# EAGLE board T-Bone_V101 (EAGLE 6.5.0), part 1 of 3
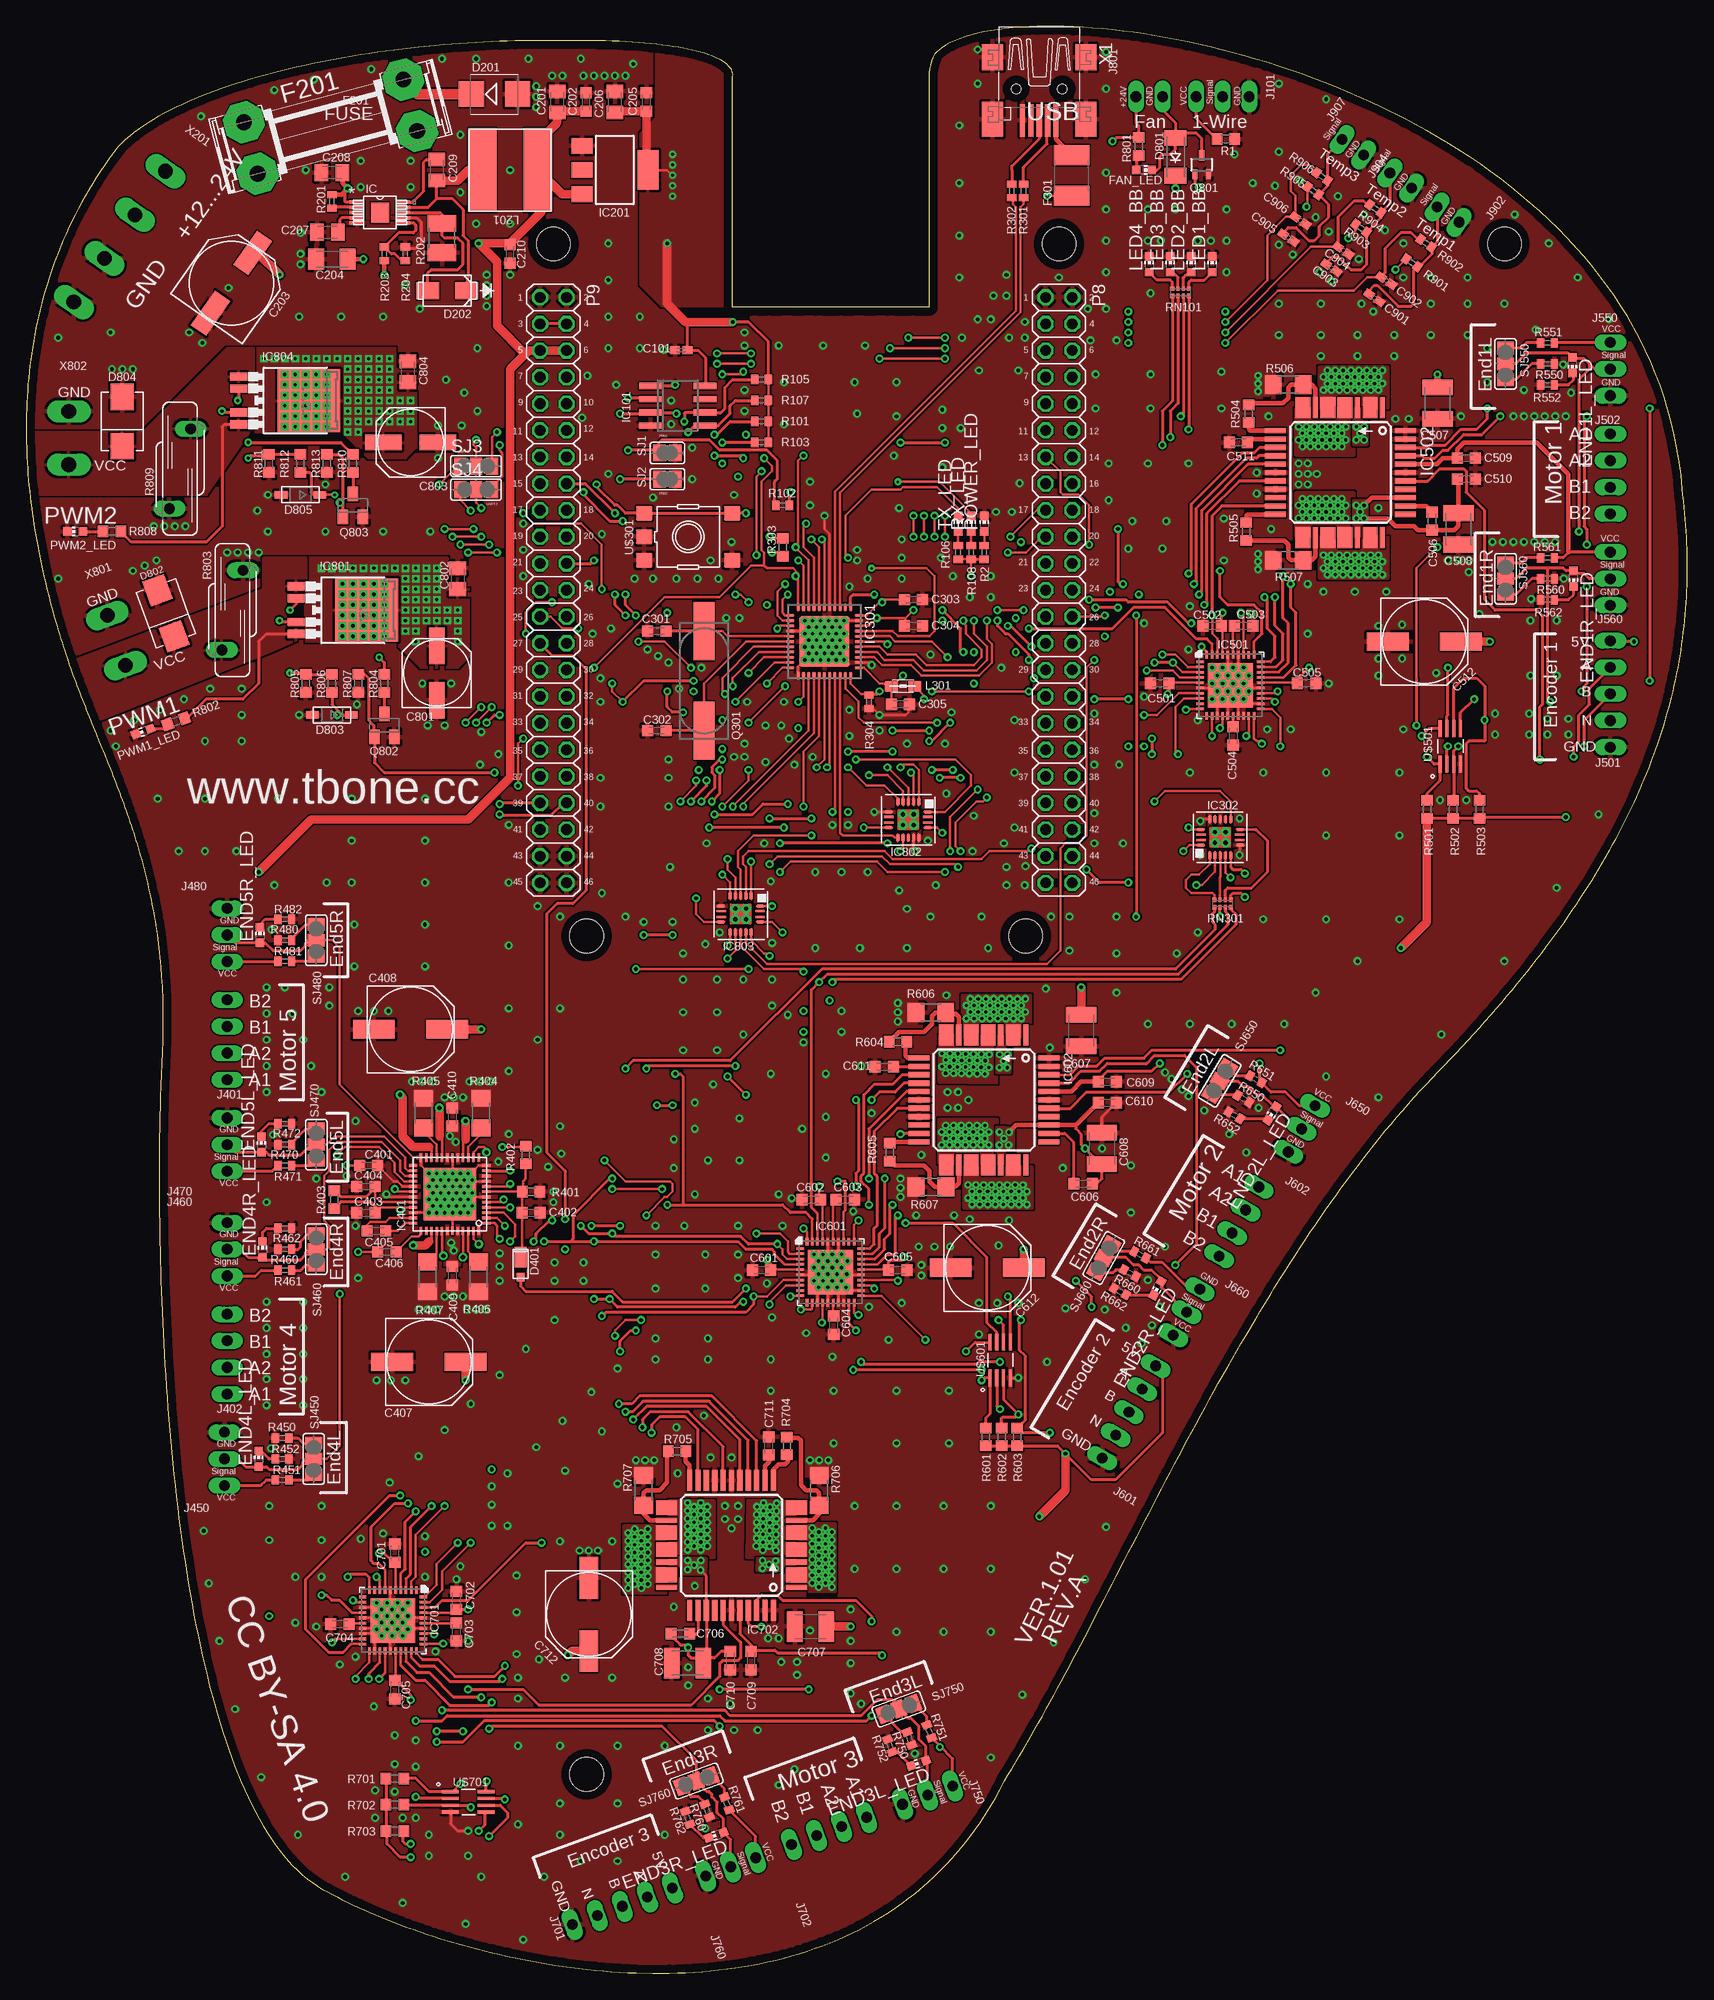
[diagram p10: board, top side]
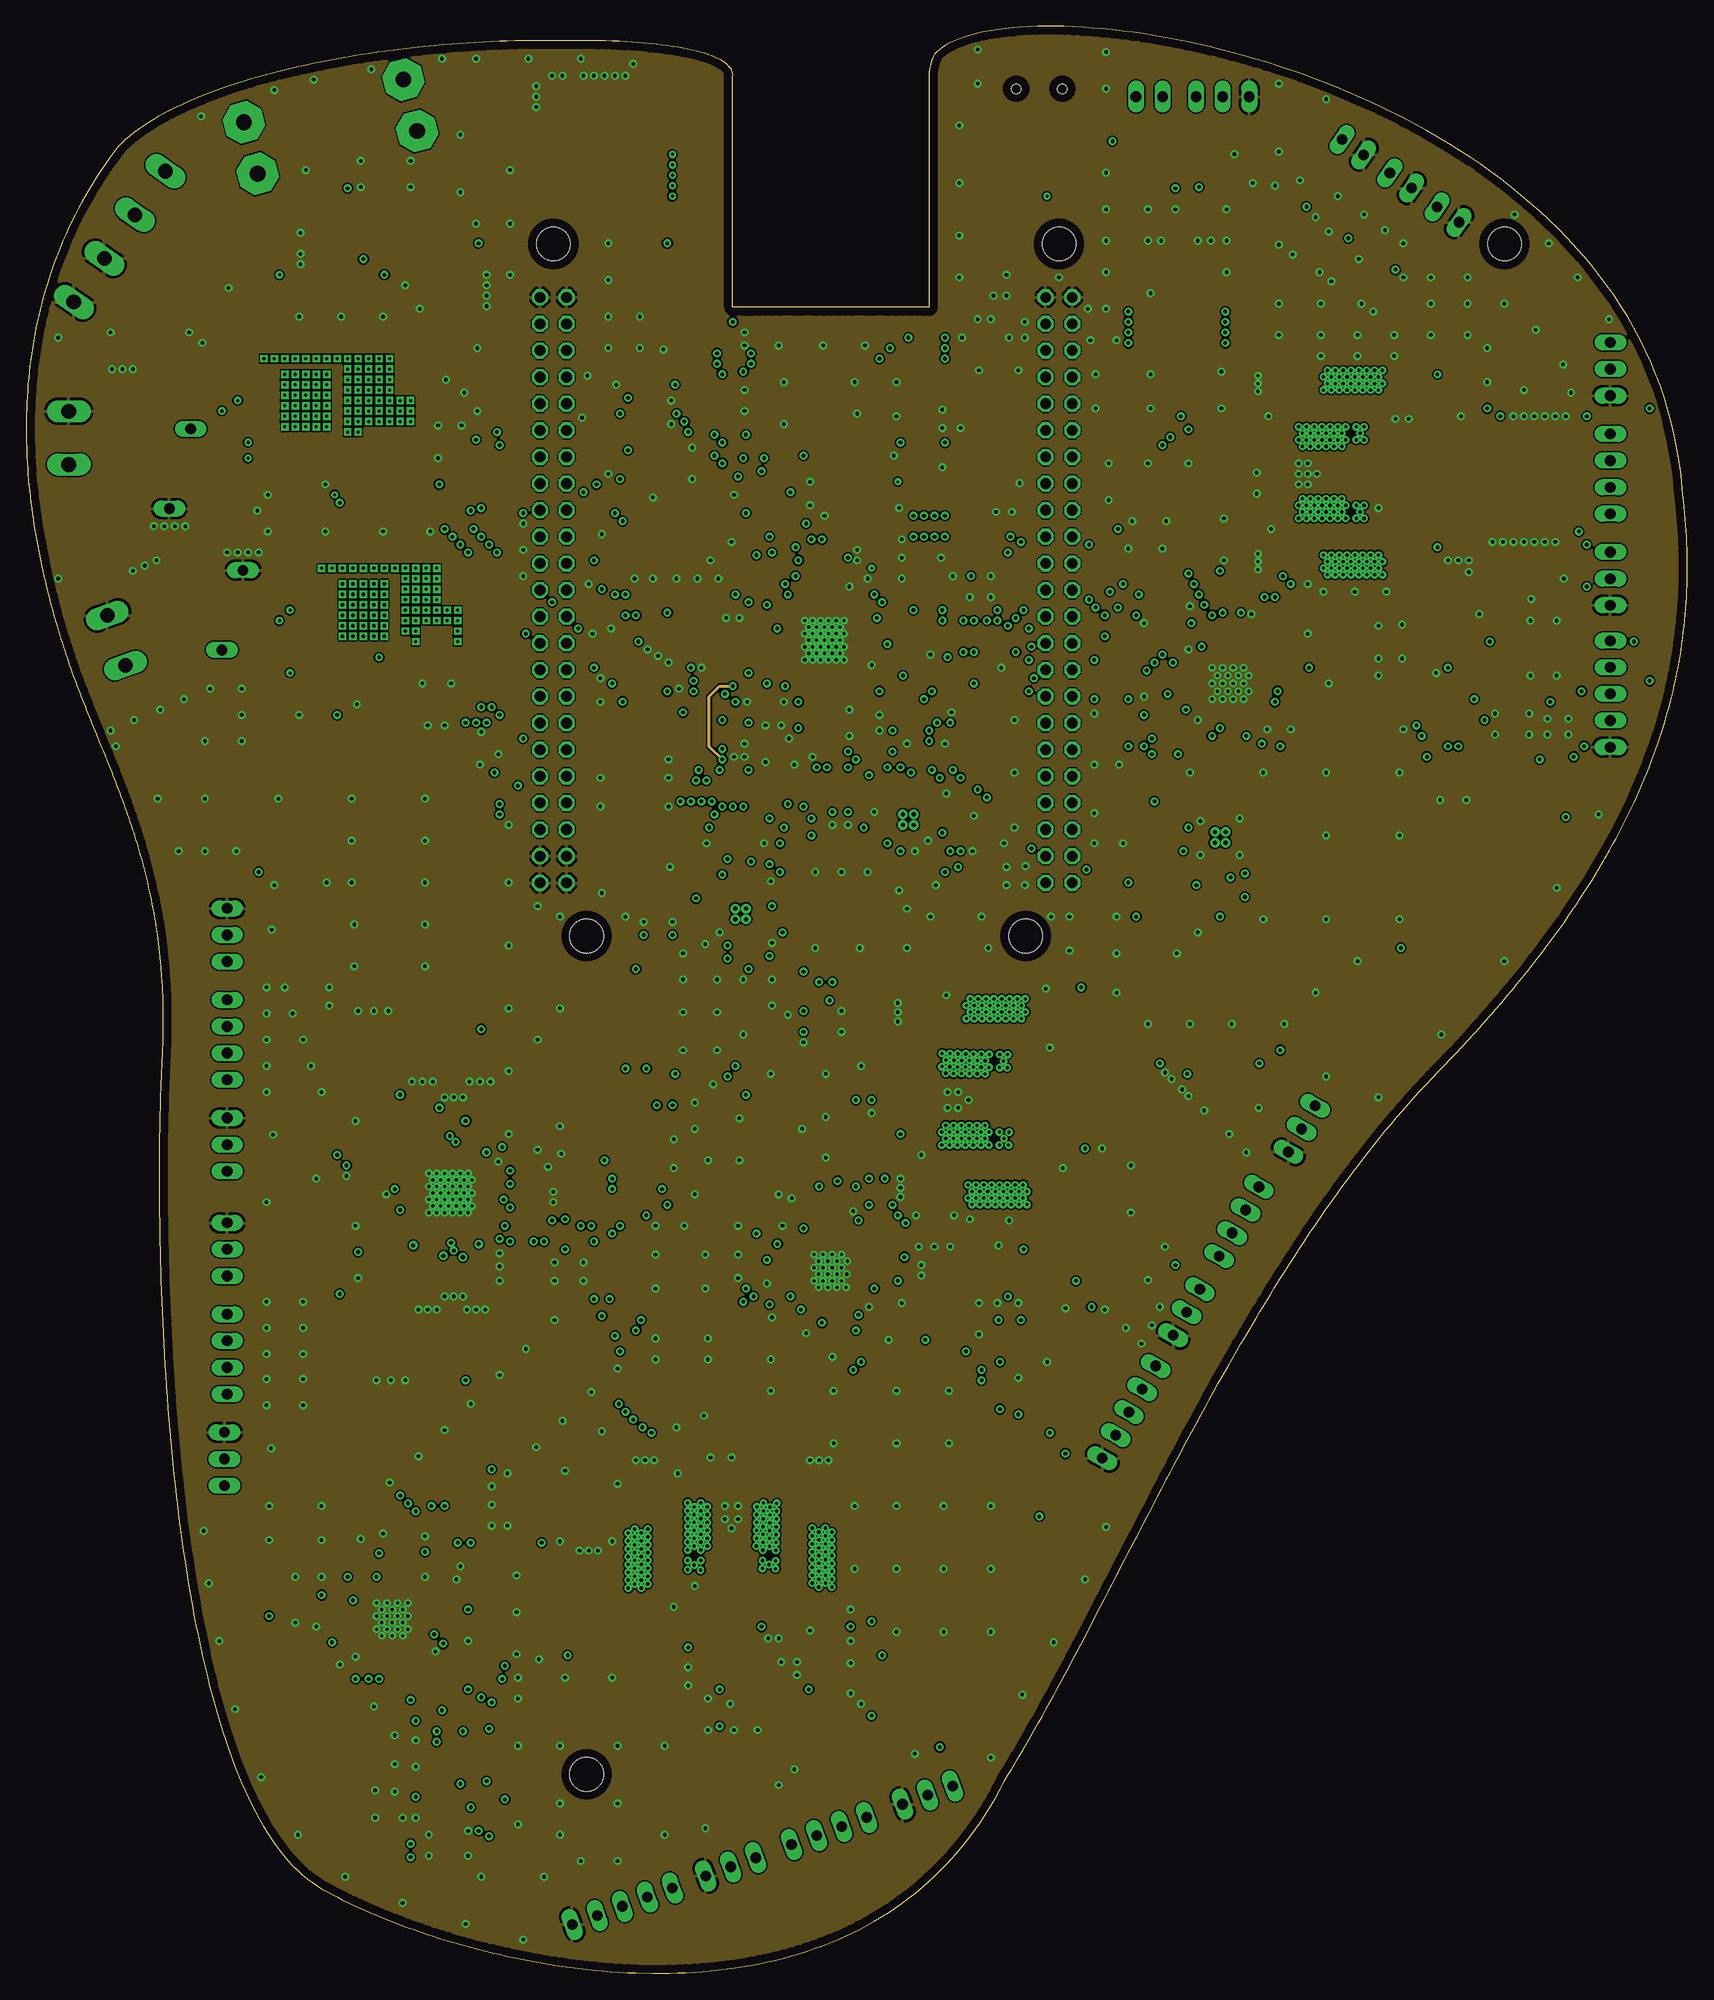
[diagram p11: board, inner layer Ground]
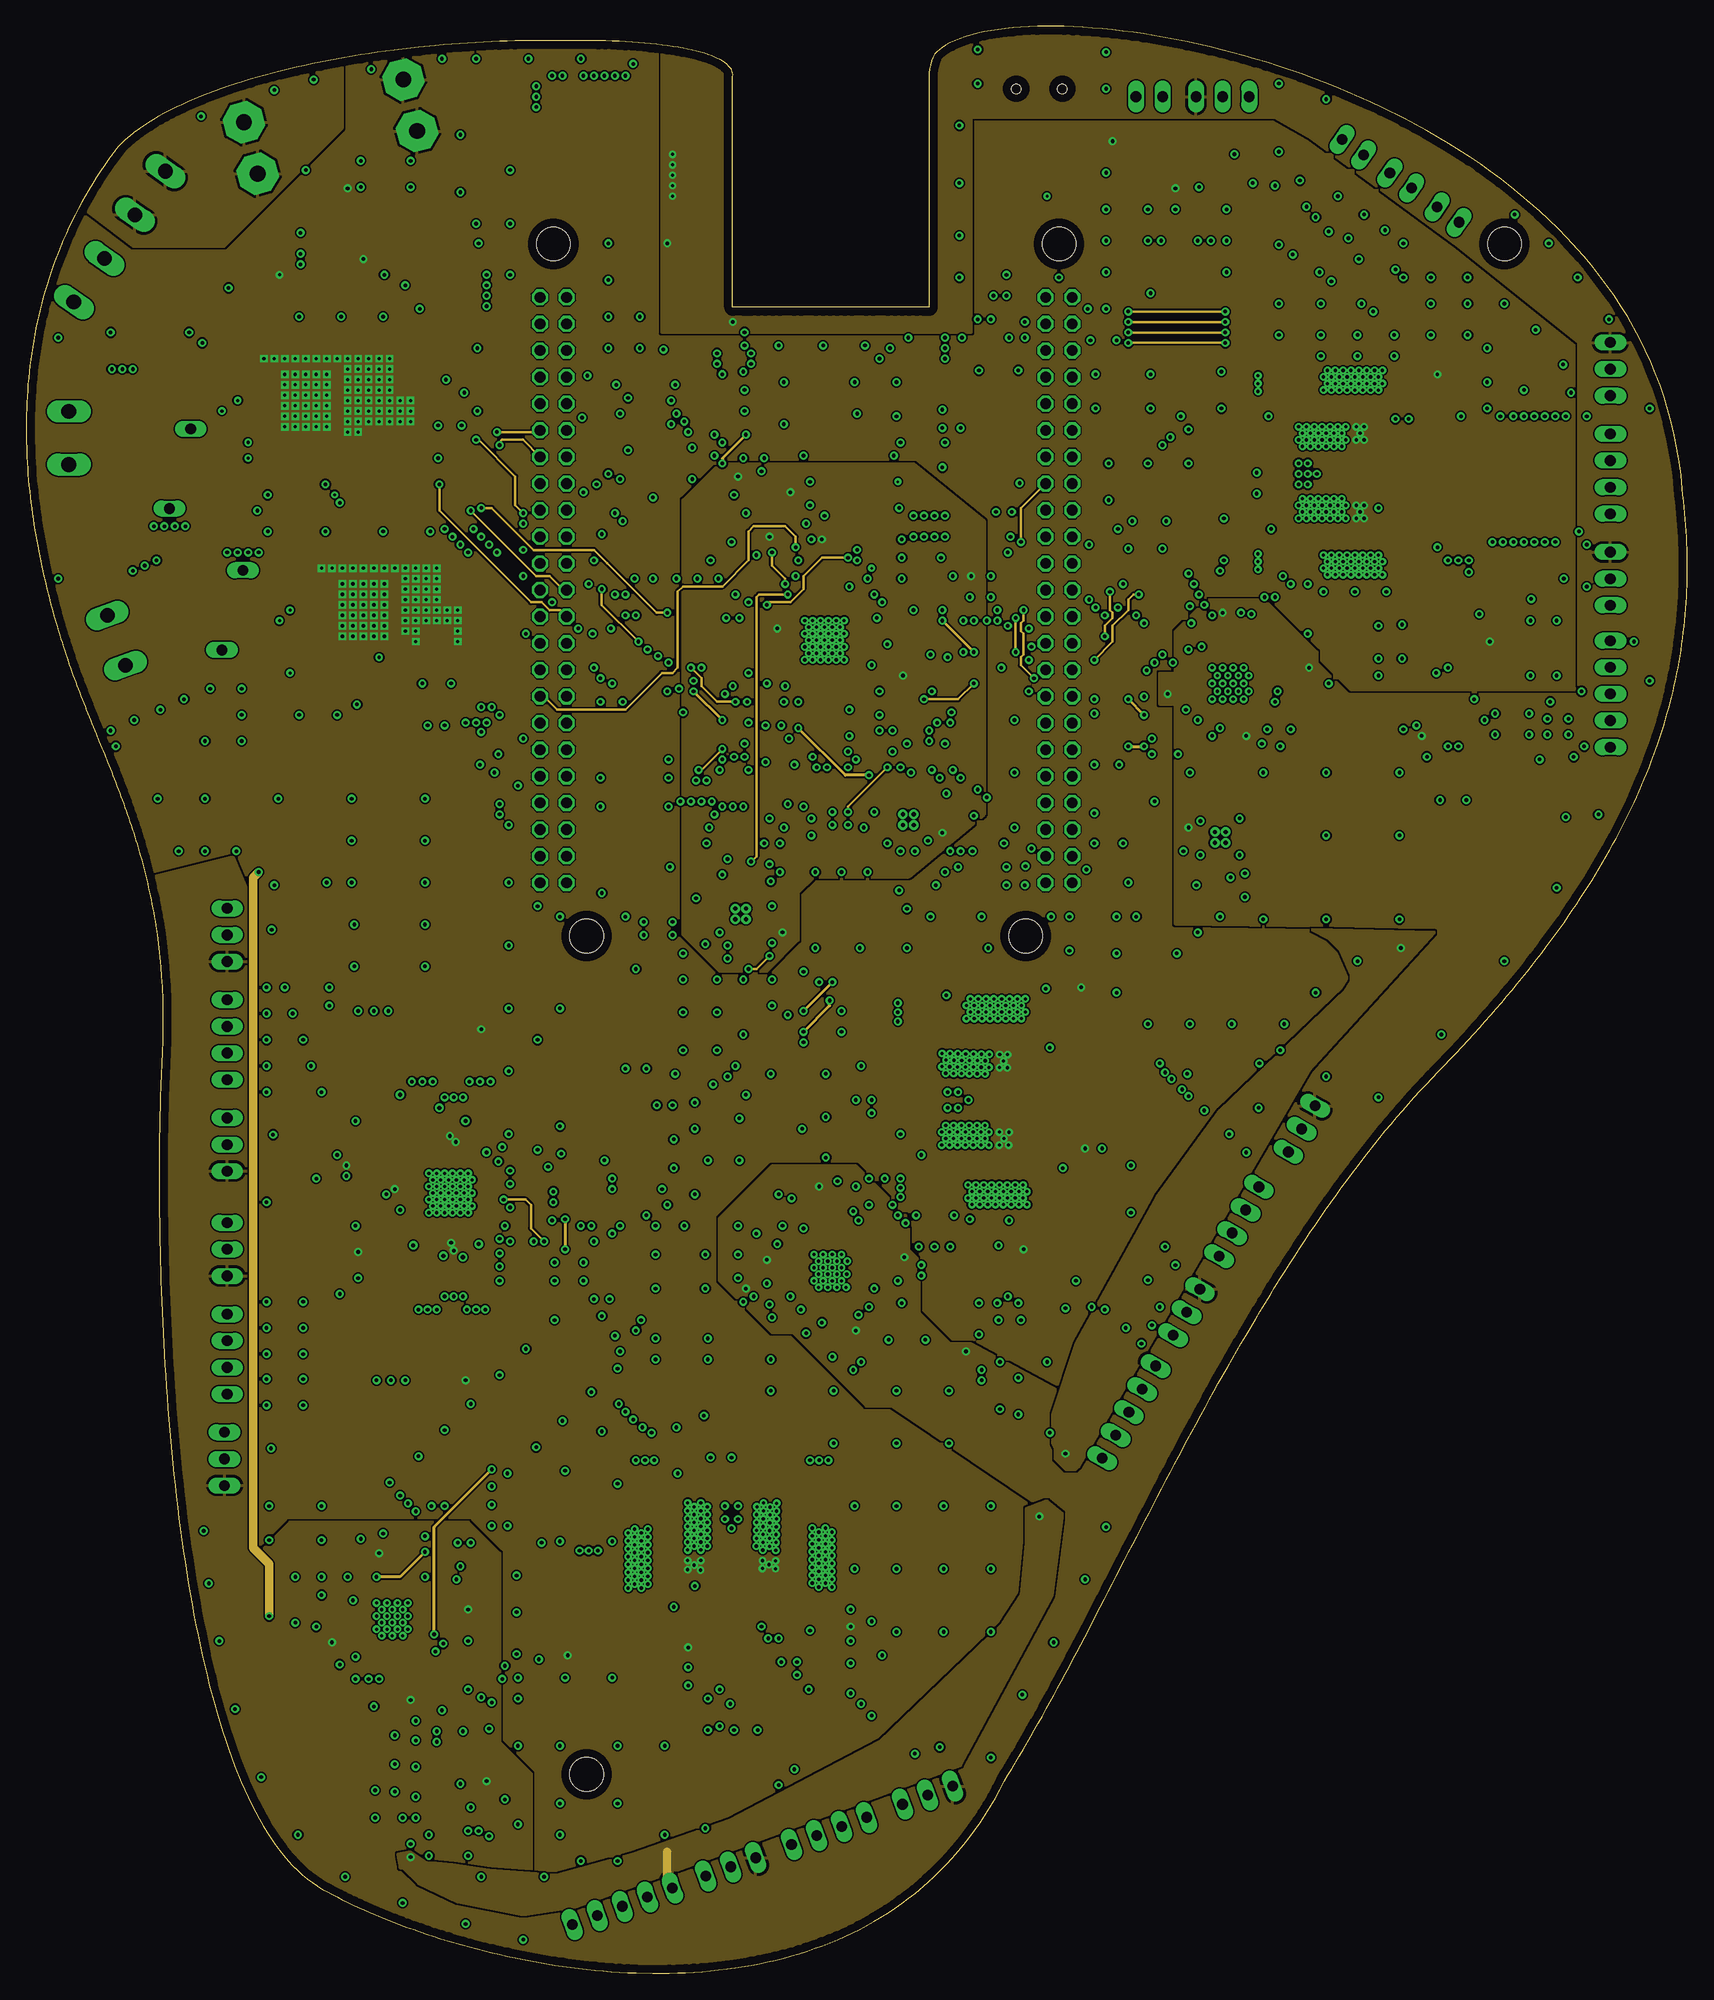
[diagram p12: board, inner layer Supply]
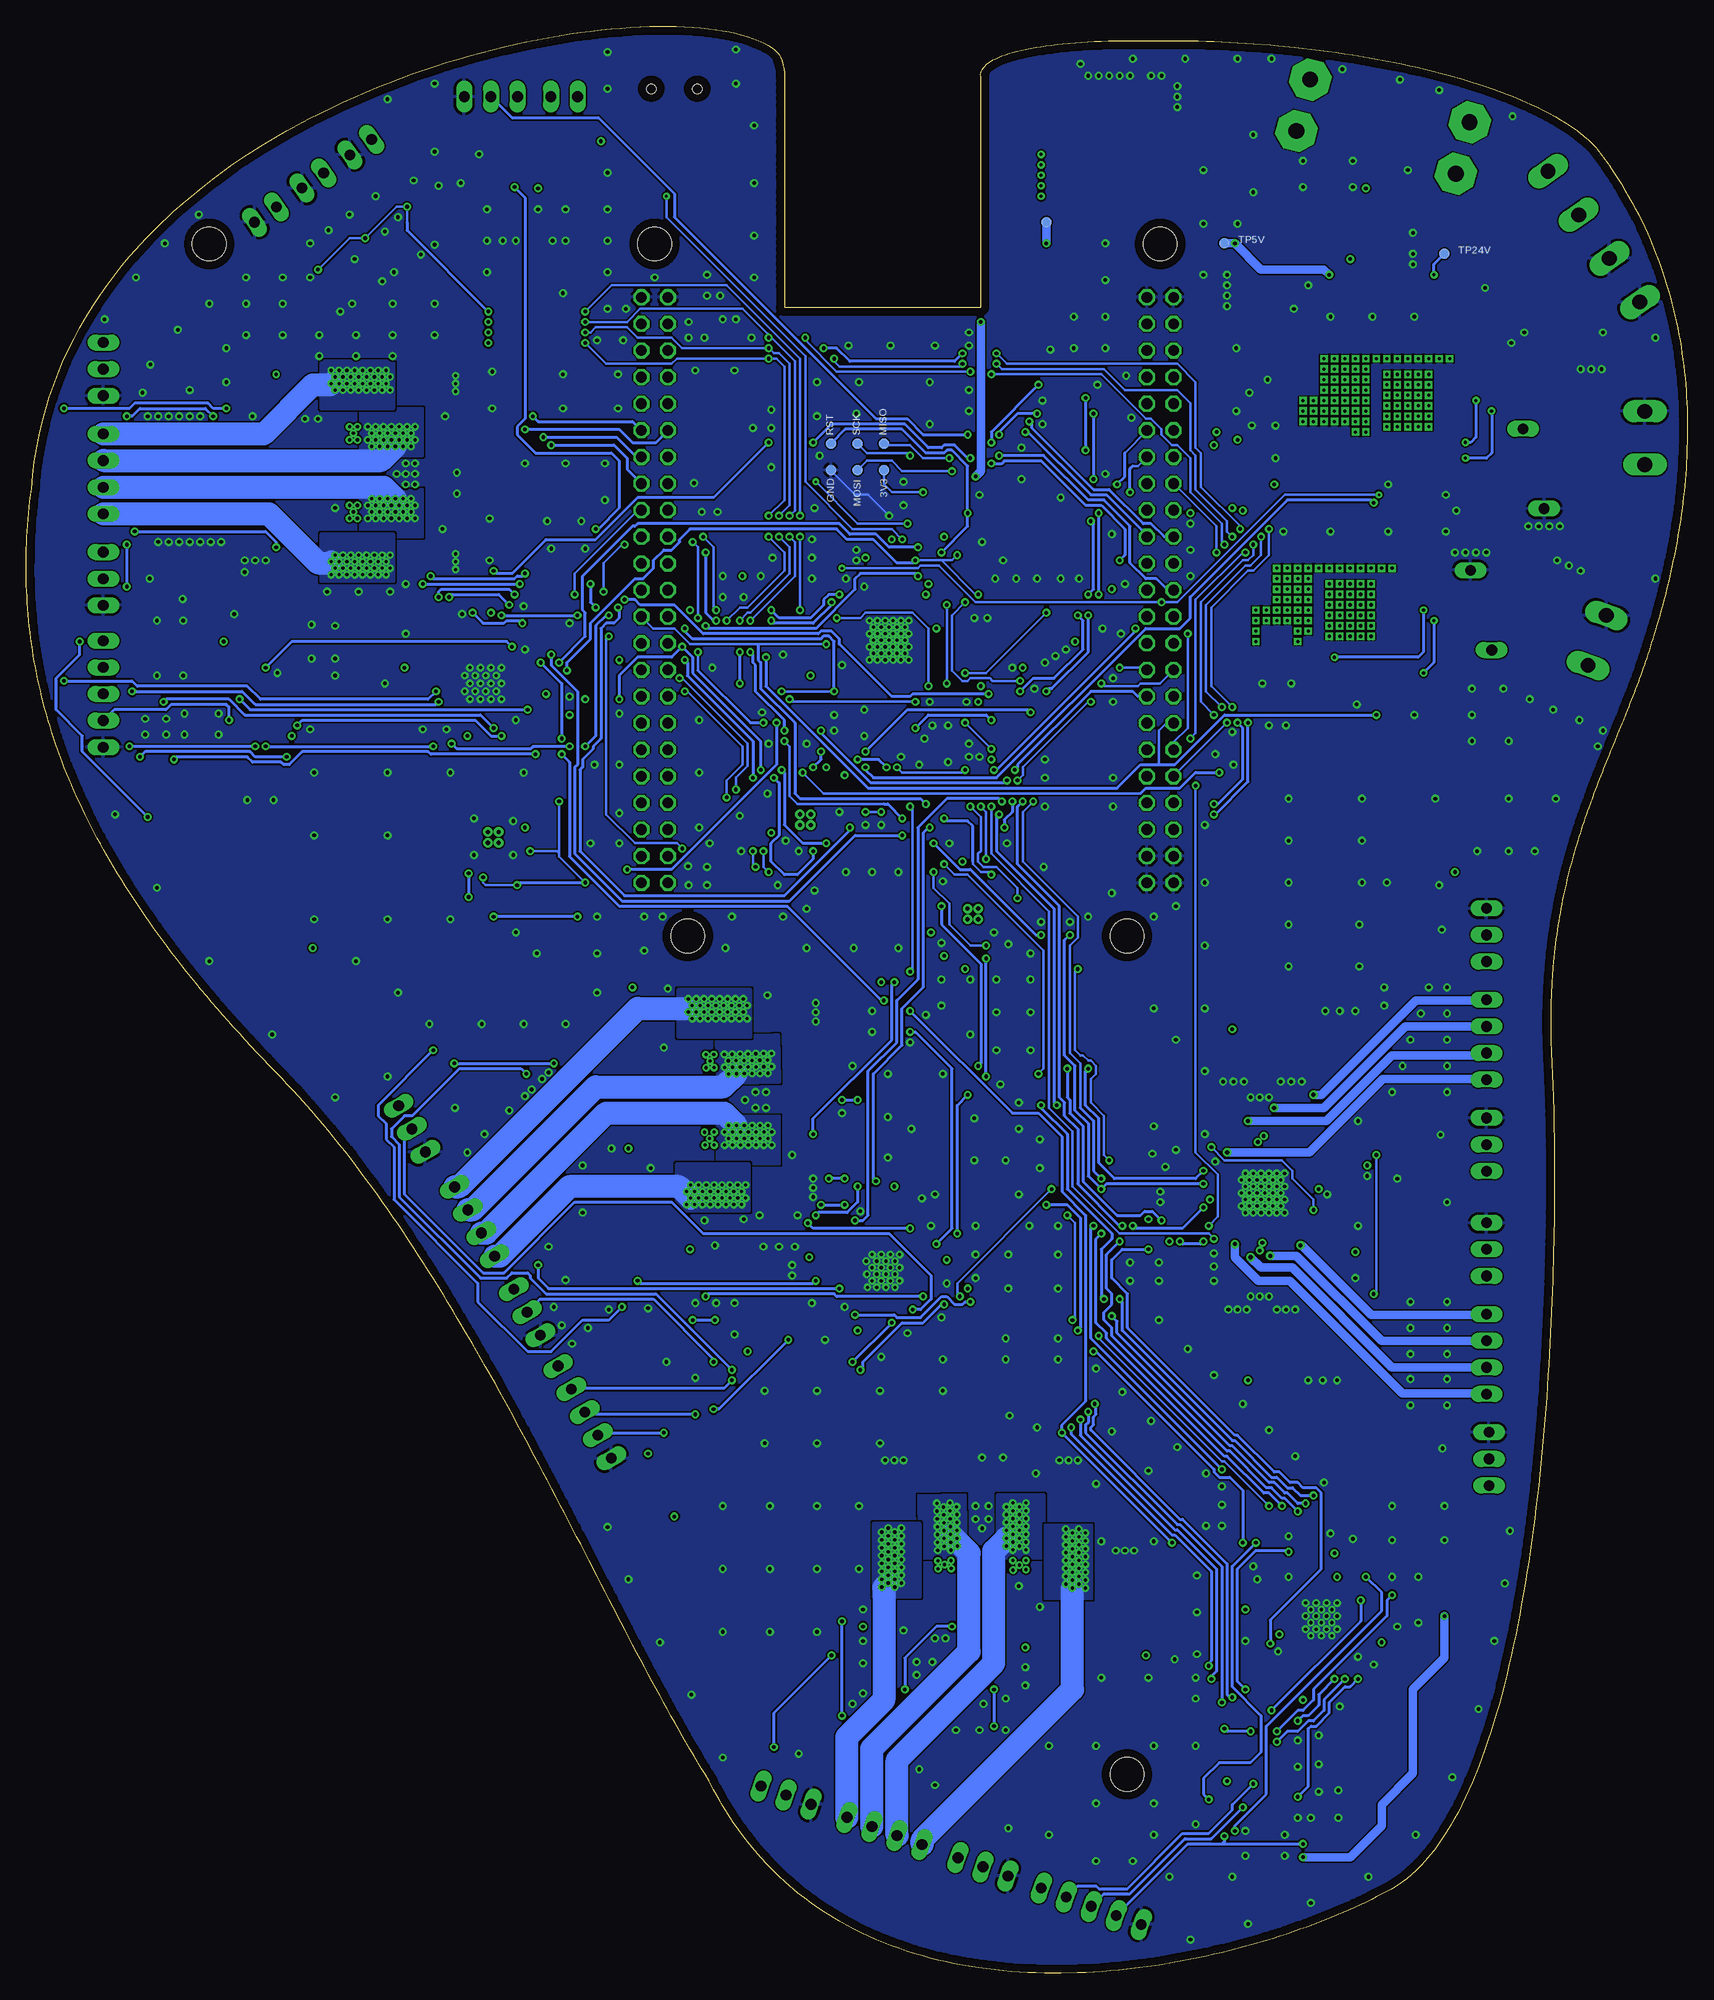
[diagram p13: board, bottom side, seen from below]

Size 158.54 x 185.81 mm. Coordinates in mm from the lower left corner, seen from the top.
Outline: 783 segments
Copper layers (1*2*15*16): Top 0.018mm / dielectric 0.36mm / Ground 0.035mm / dielectric 0.71mm / Supply 0.035mm / dielectric 0.2mm / Bottom 0.018mm
Design rules "Default_WE_Euro *": minimum track width 0.15mm, minimum drill 0.25mm, track to track 0.15mm, track to pad 0.15mm, pad to pad 0.1mm, via to via 0.15mm, smd to smd 0mil, copper to edge 0.8mm, drill to drill 8mil, minimum pad ring 10mil, minimum via ring 8mil, stop-mask expansion 4mil, vias tented up to drill 0.4mm, thermal gap 10mil
Net classes: 1 coil_current: width 0.254 mm, drill 1.2 mm, clearance 0.254 mm
Holes 3.2 mm at 50.31,165.03 98.57,165.03 95.39,98.99 53.48,98.99 141.07,165.03 53.48,18.99

## Footprints (pad centres in the part's own frame; a part is rotated, then mirrored left to right if it is on the bottom)
TP = smd 1 x 1: P$1 0,0
C0402K = smd 0.925 x 0.74: 1 -0.6,0; 2 0.6,0
C0805K = smd 1.3 x 1.6: 1 -1,0; 2 1,0
C0603K = smd 1.05 x 1.08: 1 -0.875,0; 2 0.875,0
F = smd 1.75 x 4: 1 0,-3.5; 2 0,3.5
C1206K = smd 1.5 x 2: 1 -1.5,0; 2 1.5,0
C1210K = smd 1.5 x 2.9: 1 -1.5,0; 2 1.5,0
D8 = smd 1.5 x 3.5: 1 0,-2.6; 2 0,2.6
SMB = smd 2.4 x 2.4: A 2.2,0; C -2.2,0
SMA = smd 2.184 x 1.626: 1 -1.854,0; 2 1.854,0
MSS1PX = smd 2 x 1.1: 1 -1.25,0 | smd 0.8 x 0.8: 2 0.65,0
SOD-123_MINI-SMA = smd 1.5 x 2.1: A 1.8,0; C -1.8,0
SMB' = smd 2.5 x 2.2: A 2.35,0; C -2.35,0
SOD-123 = smd 1.2 x 0.7: A 1.85,0; C -1.85,0
CHIP-LED0603 = smd 0.8 x 0.8: A 0,-0.75; C 0,0.75
SHK20Q = drill 1.5 pad 3.81 octagon: 1A -7.874,2.54; 1B -7.874,-2.54; 2A 7.874,2.54; 2B 7.874,-2.54
L1812 = smd 1.9 x 3.4: 1 -1.95,0; 2 1.95,0
MUC10A = smd 1.372 x 0.33: 1 -2.184,0.991; 2 -2.184,0.508; 3 -2.184,0; 4 -2.184,-0.508; 5 -2.184,-0.991; 6 2.184,-0.991; 7 2.184,-0.508; 8 2.184,0; 9 2.184,0.508; 10 2.184,0.991 | smd 1.727 x 1.905: EPAD 0,0
SO-08 = smd 0.6 x 2.2: 1 -1.905,-2.6; 2 -0.635,-2.6; 3 0.635,-2.6; 4 1.905,-2.6; 5 1.905,2.6; 6 0.635,2.6; 7 -0.635,2.6; 8 -1.905,2.6
SOT223 = smd 1.5 x 2: 1 -2.3,-3.15; 2 0,-3.15; 3 2.3,-3.15 | smd 3.8 x 2: 4 0,3.15
QFN44ML7X7 = smd 0.75 x 0.275: 1 -3.275,2.5; 2 -3.275,2; 3 -3.275,1.5; 4 -3.275,1; 5 -3.275,0.5; 6 -3.275,0; 7 -3.275,-0.5; 8 -3.275,-1; 9 -3.275,-1.5; 10 -3.275,-2; 11 -3.275,-2.5; 23 3.275,-2.5; 24 3.275,-2; 25 3.275,-1.5; 26 3.275,-1; 27 3.275,-0.5; 28 3.275,0; 29 3.275,0.5; 30 3.275,1; 31 3.275,1.5; 32 3.275,2; 33 3.275,2.5 | smd 0.275 x 0.75: 12 -2.5,-3.275; 13 -2,-3.275; 14 -1.5,-3.275; 15 -1,-3.275; 16 -0.5,-3.275; 17 0,-3.275; 18 0.5,-3.275; 19 1,-3.275; 20 1.5,-3.275; 21 2,-3.275; 22 2.5,-3.275; 34 2.5,3.275; 35 2,3.275; 36 1.5,3.275; 37 1,3.275; 38 0.5,3.275; 39 0,3.275; 40 -0.5,3.275; 41 -1,3.275; 42 -1.5,3.275; 43 -2,3.275; 44 -2.5,3.275 | smd 4.826 x 4.826: EXP 0,0
14-VFQFN = smd 0.85 x 0.28: 1 1.875,0.75; 7 -1.875,0.75; 8 -1.875,-0.75; 14 1.875,-0.75 | smd 0.28 x 0.85: 2 1,1.725; 3 0.5,1.725; 4 0,1.725; 5 -0.5,1.725; 6 -1,1.725; 9 -1,-1.725; 10 -0.5,-1.725; 11 0,-1.725; 12 0.5,-1.725; 13 1,-1.725 | smd 0.9 x 0.2: THERM@1 1.85,-0.275; THERM@2 1.85,0.275; THERM@3 -1.85,0.275; THERM@4 -1.85,-0.275 | drill 0.406: THERM@5 -0.512,0.512; THERM@6 -0.512,-0.512; THERM@7 0.512,-0.512; THERM@8 0.512,0.512
QFN48 = smd 0.25 x 0.8: 1 -2.75,-3.5; 2 -2.25,-3.5; 3 -1.75,-3.5; 4 -1.25,-3.5; 5 -0.75,-3.5; 6 -0.25,-3.5; 7 0.25,-3.5; 8 0.75,-3.5; 9 1.25,-3.5; 10 1.75,-3.5; 11 2.25,-3.5; 12 2.75,-3.5; 25 2.75,3.5; 26 2.25,3.5; 27 1.75,3.5; 28 1.25,3.5; 29 0.75,3.5; 30 0.25,3.5; 31 -0.25,3.5; 32 -0.75,3.5; 33 -1.25,3.5; 34 -1.75,3.5; 35 -2.25,3.5; 36 -2.75,3.5 | smd 0.8 x 0.25: 13 3.5,-2.75; 14 3.5,-2.25; 15 3.5,-1.75; 16 3.5,-1.25; 17 3.5,-0.75; 18 3.5,-0.25; 19 3.5,0.25; 20 3.5,0.75; 21 3.5,1.25; 22 3.5,1.75; 23 3.5,2.25; 24 3.5,2.75; 37 -3.5,2.75; 38 -3.5,2.25; 39 -3.5,1.75; 40 -3.5,1.25; 41 -3.5,0.75; 42 -3.5,0.25; 43 -3.5,-0.25; 44 -3.5,-0.75; 45 -3.5,-1.25; 46 -3.5,-1.75; 47 -3.5,-2.25; 48 -3.5,-2.75 | smd 5 x 5: 49 0,0
QFN40L = smd 0.7 x 0.25: 1 -2.9,2.25; 2 -2.9,1.75; 3 -2.9,1.25; 4 -2.9,0.75; 5 -2.9,0.25; 6 -2.9,-0.25; 7 -2.9,-0.75; 8 -2.9,-1.25; 9 -2.9,-1.75; 10 -2.9,-2.25; 21 2.9,-2.25; 22 2.9,-1.75; 23 2.9,-1.25; 24 2.9,-0.75; 25 2.9,-0.25; 26 2.9,0.25; 27 2.9,0.75; 28 2.9,1.25; 29 2.9,1.75; 30 2.9,2.25 | smd 0.25 x 0.7: 11 -2.25,-2.9; 12 -1.75,-2.9; 13 -1.25,-2.9; 14 -0.75,-2.9; 15 -0.25,-2.9; 16 0.25,-2.9; 17 0.75,-2.9; 18 1.25,-2.9; 19 1.75,-2.9; 20 2.25,-2.9; 31 2.25,2.9; 32 1.75,2.9; 33 1.25,2.9; 34 0.75,2.9; 35 0.25,2.9; 36 -0.25,2.9; 37 -0.75,2.9; 38 -1.25,2.9; 39 -1.75,2.9; 40 -2.25,2.9 | smd 4.26 x 4.26: EXP 0,0
PQFP44_WITH_PADS = smd 2 x 0.5: 1 -6.327,4.254; 4 -6.327,1.854; 9 -6.327,-2.146; 25 6.073,-2.146; 30 6.073,1.854; 33 6.073,4.254 | smd 2 x 1.4: 2 -6.327,3.06; 5 -6.327,0.66; 7 -6.327,-0.965; 10 -6.327,-3.34; 23 6.073,-3.34; 26 6.073,-0.965; 28 6.073,0.66; 31 6.073,3.06 | smd 0.5 x 2: 12 -4.127,-5.946; 13 -3.327,-5.946; 14 -2.527,-5.946; 15 -1.727,-5.946; 16 -0.927,-5.946; 17 -0.127,-5.946; 18 0.673,-5.946; 19 1.473,-5.946; 20 2.273,-5.946; 21 3.073,-5.946; 22 3.873,-5.946; 34 3.873,6.454; 35 3.073,6.454; 36 2.273,6.454; 37 1.473,6.454; 38 0.673,6.454; 39 -0.127,6.454; 40 -0.927,6.454; 41 -1.727,6.454; 42 -2.527,6.454; 43 -3.327,6.454; 44 -4.127,6.454
TO252-5-11 = smd 0.8 x 1.6: 1 -2.28,-5.41; 2 -1.14,-5.41; 4 1.14,-5.41; 5 2.28,-5.41 | smd 6 x 6: TAB 0,1.3
7395-03 = drill 1.016 long: 1 2.54,0; 2 0,0; 3 -2.54,0
7395-04 = drill 1.016 long: 1 3.81,0; 2 1.27,0; 3 -1.27,0; 4 -3.81,0
7395-05 = drill 1.016 long: 1 5.08,0; 2 2.54,0; 3 0,0; 4 -2.54,0; 5 -5.08,0
7395-02 = drill 1.016 long: 1 1.27,0; 2 -1.27,0
SDR0805 = smd 2.692 x 8.001: 1 -2.642,0; 2 2.642,0
0805 = smd 1.2 x 1: 1 -1.1,0; 2 1.1,0
2X23 = drill 1.016 octagon: 1 -25.4,-1.27; 2 -25.4,1.27; 3 -22.86,-1.27; 4 -22.86,1.27; 5 -20.32,-1.27; 6 -20.32,1.27; 7 -17.78,-1.27; 8 -17.78,1.27; 9 -15.24,-1.27; 10 -15.24,1.27; 11 -12.7,-1.27; 12 -12.7,1.27; 13 -10.16,-1.27; 14 -10.16,1.27; 15 -7.62,-1.27; 16 -7.62,1.27; 17 -5.08,-1.27; 18 -5.08,1.27; 19 -2.54,-1.27; 20 -2.54,1.27; 21 0,-1.27; 22 0,1.27; 23 2.54,-1.27; 24 2.54,1.27; 25 5.08,-1.27; 26 5.08,1.27; 27 7.62,-1.27; 28 7.62,1.27; 29 10.16,-1.27; 30 10.16,1.27; 31 12.7,-1.27; 32 12.7,1.27; 33 15.24,-1.27; 34 15.24,1.27; 35 17.78,-1.27; 36 17.78,1.27; 37 20.32,-1.27; 38 20.32,1.27; 39 22.86,-1.27; 40 22.86,1.27; 41 25.4,-1.27; 42 25.4,1.27; 43 27.94,-1.27; 44 27.94,1.27; 45 30.48,-1.27; 46 30.48,1.27
CSM-7X-DU = smd 5.5 x 2: 1 -4.75,0; 2 4.75,0
SOT323 = smd 0.5 x 1: 1 0,0.9; 2 -0.65,-0.9; 3 0.65,-0.9
SOT23 = smd 1 x 1.4: 1 -0.95,-1.1; 2 0.95,-1.1; 3 0,1.1
R0603 = smd 1 x 1.1: 1 -0.85,0; 2 0.85,0
R0402 = smd 0.7 x 0.9: 1 -0.65,0; 2 0.65,0
R1210 = smd 1.6 x 2.7: 1 -1.4,0; 2 1.4,0
R1206 = smd 1.6 x 1.803: 1 -1.422,0; 2 1.422,0
S10K40 = drill 1.016 long: 1 -1.016,-3.81; 2 1.016,3.81
YC124 = smd 0.4 x 0.4: 1 -0.8,-0.35; 4 0.8,-0.35; 5 0.8,0.35; 8 -0.8,0.35 | smd 0.3 x 0.4: 2 -0.25,-0.35; 3 0.25,-0.35; 6 0.25,0.35; 7 -0.25,0.35
SJ = smd 1.168 x 1.6: 1 -0.762,0; 2 0.762,0
SJ_2 = smd 1.168 x 1.6: 1 -1.524,0; 2 0,0; 3 1.524,0
TS42 = smd 1.6 x 1.4: 1 -4.2,2.25; 2 4.2,2.25; 3 -4.2,-2.25; 4 4.2,-2.25; 5 -4.2,0
SN74LVC3G17-SM8 = smd 1.6 x 0.3: P$1 -1.7,1; P$2 -1.7,0.35; P$3 -1.7,-0.3; P$4 -1.7,-0.95; P$5 1.7,-0.95; P$6 1.7,-0.3; P$7 1.7,0.35; P$8 1.7,1
32005-301 = smd 3.1 x 0.5: 1 3,1.6; 2 3,0.8; 3 3,0; 4 3,-0.8; 5 3,-1.6 | smd 2.5 x 2: M1 -3,-4.45; M2 -3,4.45 | smd 3.3 x 2: M3 2.9,4.45; M4 2.9,-4.45 | hole 0.9: 0,2.2; 0,-2.2
MSTBA4 = drill 1.397 long: 1 -7.62,5.08; 2 -2.54,5.08; 3 2.54,5.08; 4 7.62,5.08
MSTBA2 = drill 1.397 long: 1 -2.54,5.08; 2 2.54,5.08

## Placement (x,y rotation side)
3V3  TP  [TP]  76.66,143.45 270 bottom
C101  100nF/10V  [C0402K]  62.51,154.91 180 top
C201  10µF/10V  [C0805K]  50.68,178.59 90 top
C202  100nF/50V  [C0603K]  53.43,178.59 90 top
C203  100µF/35V  [F]  19.59,161.3 325 top
C204  1.0µF/50V  [C1206K]  29.18,163.59 180 top
C205  100nF/50V  [C0603K]  59.18,178.59 90 top
C206  10µF/10V  [C0805K]  56.18,178.59 90 top
C207  10nF/50V  [C0805K]  28.75,166.15 180 top
C208  1.0µF/35V  [C0805K]  29.18,171.84 180 top
C209  100nF/25V  [C0805K]  39.18,172.09 270 top
C210  10.0µF/50V  [C0603K]  46.18,164.09 270 top
C301  22pF/50V  [C0603K]  60.18,128.09 0 top
C302  22pF/50V  [C0603K]  60.18,118.59 0 top
C303  1.0µF/50V  [C0603K]  84.68,131.09 0 top
C304  100nF/50V  [C0603K]  84.68,128.59 0 top
C305  1.0µF/50V  [C0603K]  83.43,121.09 0 top
C401  100nF/50V  [C0603K]  32.68,77.09 0 top
C402  22nF/50V  [C0603K]  48.18,72.59 0 top
C403  470nF/16V  [C0603K]  32.43,72.59 180 top
C404  4.7µF/16V  [C0603K]  32.43,75.09 180 top
C405  22nF/50V  [C0603K]  33.43,70.84 180 top
C406  100nF/50V  [C0603K]  34.43,68.84 180 top
C407  220µF/35V  [F]  38.43,58.34 270 top
C408  220µF/35V  [F]  36.68,90.09 270 top
C409  100nF/50V  [C0603K]  40.68,66.59 270 top
C410  100nF/50V  [C0603K]  40.68,81.71 90 top
C501  100nF/50V  [C0603K]  108.18,123.09 180 top
C502  100nF/50V  [C0603K]  113.18,128.59 0 top
C503  100nF/50V  [C0603K]  116.18,128.59 180 top
C504  100nF/50V  [C0603K]  115.18,118.09 270 top
C505  100nF/50V  [C0603K]  122.18,123.09 0 top
C506  220nF/16V  [C0603K]  134.18,138.59 90 top
C507  10µF/35V  [C1210K]  134.68,149.84 270 top
C508  10µF/35V  [C1210K]  136.68,137.84 270 top
C509  100nF/50V  [C0603K]  137.43,144.59 0 top
C510  100nF/50V  [C0603K]  137.43,142.59 0 top
C511  0.47µF/16V  [C0603K]  115.68,146.09 180 top
C512  220µF/35V  [F]  133.43,127.09 270 top
C601  100nF/35V  [C0603K]  70.18,67.09 180 top
C602  100nF/50V  [C0603K]  74.93,73.84 0 top
C603  100nF/50V  [C0603K]  78.18,73.84 180 top
C604  100nF/35V  [C0603K]  77.06,61.84 270 top
C605  100nF/35V  [C0603K]  83.18,67.09 0 top
C606  220nF/16V  [C0603K]  100.89,75.37 180 top
C607  10µF/35V  [C1210K]  100.7,89.96 270 top
C608  10µF/35V  [C1210K]  102.67,78.72 90 top
C609  100nF/50V  [C0603K]  103.18,85.09 0 top
C610  100nF/50V  [C0603K]  103.18,83.09 0 top
C611  0.47µF/16V  [C0603K]  81.88,86.53 180 top
C612  220µF/35V  [F]  91.73,67.33 270 top
C701  100nF/50V  [C0603K]  35.18,40.09 90 top
C702  100nF/50V  [C0603K]  41.06,35.59 270 top
C703  100nF/50V  [C0603K]  41.06,32.59 90 top
C704  100nF/50V  [C0603K]  29.93,33.34 180 top
C705  100nF/50V  [C0603K]  35.18,27.09 270 top
C706  220nF/16V  [C0603K]  62.43,32.41 0 top
C707  10µF/35V  [C1210K]  74.86,33.09 180 top
C708  10µF/35V  [C1210K]  63.11,29.59 180 top
C709  100nF/50V  [C0603K]  69.18,29.84 270 top
C710  100nF/50V  [C0603K]  67.18,29.84 270 top
C711  0.47µF/16V  [C0603K]  70.86,50.34 90 top
C712  220µF/35V  [F]  53.7,34.25 180 top
C801  10µF/50V  [D8]  39.18,124.09 0 top
C802  100nF/50V  [C0805K]  41.18,133.09 90 top
C803  10µF/50V  [D8]  36.68,146.09 90 top
C804  100nF/50V  [C0805K]  36.43,152.84 90 top
C901  470nF/50V  [C0402K]  128.65,159.9 325 top
C902  470nF/50V  [C0402K]  129.8,161.53 325 top
C903  470nF/50V  [C0402K]  124.56,162.76 325 top
C904  470nF/50V  [C0402K]  125.7,164.4 325 top
C905  470nF/50V  [C0402K]  120.46,165.63 325 top
C906  470nF/50V  [C0402K]  121.61,167.27 325 top
D201  SMBJ28A  [SMB]  44.68,179.34 0 top
D202  B240A-13-F  [SMA]  40.18,160.59 180 top
D401  MSS1P3  [MSS1PX]  47.18,67.09 270 top
D801  CGRM4001-G  [SOD-123_MINI-SMA]  109.68,173.34 90 top
D802  SMBJ36CA  [SMB']  13.32,129.79 110 top
D803  MMSZ4678-TP  [SOD-123]  29.18,120.09 180 top
D804  SMBJ36CA  [SMB']  9.18,148.09 90 top
D805  MMSZ4678-TP  [SOD-123]  26.18,141.09 180 top
END1L_LED  [CHIP-LED0603]  147.56,153.46 180 top
END1R_LED  [CHIP-LED0603]  147.68,133.09 180 top
END2L_LED  [CHIP-LED0603]  118.9,82.06 149 top
END2R_LED  [CHIP-LED0603]  107.96,65.37 151 top
END3L_LED  [CHIP-LED0603]  85.16,20.06 110 top
END3R_LED  [CHIP-LED0603]  65.84,13.18 110 top
END4L_LED  [CHIP-LED0603]  22.18,49.09 0 top
END4R_LED  [CHIP-LED0603]  22.56,69.09 0 top
END5L_LED  [CHIP-LED0603]  22.43,79.09 0 top
END5R_LED  [CHIP-LED0603]  22.31,99.09 0 top
F201  [SHK20Q]  29.04,176.23 15 top
F301  MF-MSMF050-2 500mA  [L1812]  99.77,171.57 90 top
FAN_LED  TLMO1000  [CHIP-LED0603]  106.68,172.09 270 top
GND  TP  [TP]  81.74,143.45 270 bottom
IC  LM25011  [MUC10A]  33.76,168.03 0 top
IC101  CAT24C256WI-GT30SCT-ND  [SO-08]  62.18,149.59 270 top
IC201  LD1117S33TR  [SOT223]  56.18,172.09 270 top
IC301  ATMEGA32U4-XUMU  [QFN44ML7X7]  76.18,127.09 270 top
IC302  SN74LVC04ARGYR  [14-VFQFN]  113.96,108.41 180 top
IC401  TMC-5031-LA  [QFN48]  40.43,74.34 90 top
IC501  TMC4361-LI  [QFN40L]  114.92,122.91 0 top
IC502  TMC2660-PA  [PQFP44_WITH_PADS]  125.18,143.09 270 top
IC601  TMC4361-LI  [QFN40L]  76.76,66.91 0 top
IC602  TMC2660-PA  [PQFP44_WITH_PADS]  91.15,83.22 270 top
IC701  TMC4361-LI  [QFN40L]  35,33.67 270 top
IC702  TMC2660-PA  [PQFP44_WITH_PADS]  67.18,41.09 180 top
IC801  FDDS10H04A_F085A  [TO252-5-11]  31.18,130.09 270 top
IC802  74LVC32A  [14-VFQFN]  84.18,110.09 0 top
IC803  74LVC02A  [14-VFQFN]  68.18,101.09 0 top
IC804  FDDS10H04A_F085A  [TO252-5-11]  25.68,150.09 270 top
J101  22-05-7038-03  [7395-03]  114.18,179.09 180 top
J401  22-05-7048-04  [7395-04]  19.18,89.09 270 top
J402  22-05-7048-04  [7395-04]  19.18,59.09 270 top
J450  22-05-7038-03  [7395-03]  18.93,49.09 270 top
J460  22-05-7038-03  [7395-03]  19.18,69.09 270 top
J470  22-05-7038-03  [7395-03]  19.18,79.09 270 top
J480  22-05-7038-03  [7395-03]  19.18,99.09 270 top
J501  22-05-7058-05  [7395-05]  151.18,122.09 90 top
J502  22-05-7048-04  [7395-04]  151.18,143.09 90 top
J550  22-05-7038-03  [7395-03]  151.18,153.09 90 top
J560  22-05-7038-03  [7395-03]  151.18,133.09 90 top
J601  22-05-7058-05  [7395-05]  105.24,53.56 60 top
J602  22-05-7048-04  [7395-04]  115.74,71.75 60 top
J650  22-05-7038-03  [7395-03]  121.72,80.58 60 top
J660  22-05-7038-03  [7395-03]  110.74,63.09 60 top
J701  22-05-7058-05  [7395-05]  56.89,6.4 20 top
J702  22-05-7048-04  [7395-04]  76.63,13.58 20 top
J750  22-05-7038-03  [7395-03]  86.02,17 20 top
J760  22-05-7038-03  [7395-03]  67.23,10.16 20 top
J801  22-05-7028-02  [7395-02]  107.18,179.09 180 top
J902  22-05-7028-02  [7395-02]  135.7,167.83 145 top
J904  22-05-7028-02  [7395-02]  131.18,171.09 145 top
J907  22-05-7028-02  [7395-02]  126.61,174.27 145 top
L201  12µH/2A  [SDR0805]  46.18,172.09 180 top
L301  MH2029-300Y  [0805]  83.68,122.84 0 top
LED1_BB  TLMS1000  [CHIP-LED0603]  113.18,163.09 0 top
LED2_BB  TLMY1000  [CHIP-LED0603]  111.18,163.09 0 top
LED3_BB  TLMY1000  [CHIP-LED0603]  109.18,163.09 0 top
LED4_BB  TLMY1000  [CHIP-LED0603]  107.18,163.09 0 top
MISO  TP  [TP]  76.66,145.99 90 bottom
MOSI  TP  [TP]  79.2,143.45 270 bottom
P8  PINHD-2X23_2.54  [2X23]  98.56,134.55 270 top
P9  PINHD-2X23_2.54  [2X23]  50.31,134.55 270 top
POWER_LED  TLMS1000  [CHIP-LED0603]  91.43,138.34 0 top
PWM1_LED  TLMO1000  [CHIP-LED0603]  11.15,118.51 110 top
PWM2_LED  TLMO1000  [CHIP-LED0603]  4.68,137.59 90 top
Q301  CSM-7X-DU  [CSM-7X-DU]  64.68,123.34 90 top
Q801  AO7400  [SOT323]  112.18,172.59 0 top
Q802  BSS138  [SOT23]  34.18,119.09 0 top
Q803  BSS138  [SOT23]  31.18,140.09 0 top
R1  2k2, 1%  [R0603]  114.49,175.05 180 top
R2  1k0, 5%  [R0402]  91.43,135.59 270 top
R101  4k7, 1%  [R0402]  70.18,148.09 0 top
R102  4k7, 1%  [R0402]  72.18,140.09 0 top
R103  4k7, 1%  [R0402]  70.18,146.09 0 top
R105  5k6, 1%  [R0402]  70.18,152.09 0 top
R106  1k0, 5%  [R0402]  88.93,135.59 270 top
R107  5k6, 1%  [R0402]  70.18,150.09 0 top
R108  1k0, 5%  [R0402]  90.18,135.59 270 top
R201  140k, 1%  [R0402]  29.18,169.09 90 top
R202  110m, 1%  [R1210]  39.68,165.59 90 top
R203  9.76k, 1%  [R0402]  34.18,164.09 270 top
R204  10k, 1%  [R0402]  36.18,164.09 270 top
R301  22R, 1%  [R0402]  95.18,170.09 90 top
R302  22R, 1%  [R0402]  94.06,170.09 90 top
R303  10k, 5%  [R0603]  72.18,136.09 90 top
R304  10k, 5%  [R0402]  80.43,121.34 270 top
R401  2k0, 1%  [R0603]  48.18,74.59 180 top
R402  1k0, 1%  [R0603]  47.68,78.09 270 top
R403  2R2, 1%  [R0603]  29.43,73.84 90 top
R404  0R27/0.25W  [R1206]  43.43,82.09 90 top
R405  0R27/0.25W  [R1206]  37.93,82.09 90 top
R406  0R27/0.25W  [R1206]  43.18,66.46 270 top
R407  0R27/0.25W  [R1206]  38.31,66.46 270 top
R450  4k7, 1%  [R0402]  24.43,51.09 0 top
R451  4k7, 1%  [R0402]  24.43,47.09 180 top
R452  10k  [R0402]  24.43,49.09 180 top
R460  4k7, 1%  [R0402]  24.68,69.09 0 top
R461  4k7, 1%  [R0402]  24.68,67.09 180 top
R462  10k  [R0402]  24.68,71.09 180 top
R470  4k7, 1%  [R0402]  24.68,79.09 0 top
R471  4k7, 1%  [R0402]  24.68,77.09 180 top
R472  10k  [R0402]  24.68,81.09 180 top
R480  4k7, 1%  [R0402]  24.68,98.59 0 top
R481  4k7, 1%  [R0402]  24.68,96.59 180 top
R482  10k  [R0402]  24.68,100.59 180 top
R501  4k7, 1%  [R0603]  133.68,111.09 270 top
R502  4k7, 1%  [R0603]  136.18,111.09 270 top
R503  4k7, 1%  [R0603]  138.68,111.09 270 top
R504  10R  [R0603]  116.68,148.84 90 top
R505  10R  [R0603]  116.43,137.59 270 top
R506  0R10/0.5W  [R1206]  120.43,151.59 180 top
R507  0R10/0.5W  [R1206]  120.43,134.84 180 top
R550  4k7, 1%  [R0402]  145.18,153.59 180 top
R551  4k7, 1%  [R0402]  145.18,155.59 0 top
R552  10k  [R0402]  145.18,151.59 0 top
R560  4k7, 1%  [R0402]  145.18,133.09 180 top
R561  4k7, 1%  [R0402]  145.18,135.09 0 top
R562  10k  [R0402]  145.18,131.09 0 top
R601  4k7, 1%  [R0603]  91.59,51.19 270 top
R602  4k7, 1%  [R0603]  93.09,51.19 270 top
R603  4k7, 1%  [R0603]  94.59,51.19 270 top
R604  10R  [R0603]  83.2,88.92 180 top
R605  10R  [R0603]  82.43,78.36 270 top
R606  0R10/0.5W  [R1206]  86.34,91.69 180 top
R607  0R10/0.5W  [R1206]  86.35,75.04 180 top
R650  4k7, 1%  [R0402]  116.16,83.45 149 top
R651  4k7, 1%  [R0402]  117.36,85.32 329 top
R652  10k  [R0402]  115.29,81.89 329 top
R660  4k7, 1%  [R0402]  105.34,66.83 151 top
R661  4k7, 1%  [R0402]  106.31,68.57 331 top
R662  10k  [R0402]  104.37,65.08 331 top
R701  4k7, 1%  [R0603]  35.18,18.59 180 top
R702  4k7, 1%  [R0603]  35.18,16.09 180 top
R703  4k7, 1%  [R0603]  35.18,13.59 180 top
R704  10R  [R0603]  72.61,50.34 90 top
R705  10R  [R0603]  62.11,49.84 180 top
R706  0R10/0.5W  [R1206]  75.68,46.09 90 top
R707  0R10/0.5W  [R1206]  58.93,46.09 90 top
R750  4k7, 1%  [R0402]  84.3,22.41 110 top
R751  4k7, 1%  [R0402]  86.18,23.09 290 top
R752  10k  [R0402]  82.42,21.72 290 top
R760  4k7, 1%  [R0402]  64.99,15.53 110 top
R761  4k7, 1%  [R0402]  66.87,16.21 290 top
R762  10k  [R0402]  63.11,14.84 290 top
R801  12k0, 1%  [R0603]  106.18,174.34 90 top
R802  12k0, 1%  [R0603]  14.3,119.48 20 top
R803  S10K35  [S10K40]  19.68,130.09 180 top
R804  180R, 1%  [R0603]  34.18,123.09 90 top
R805  1k0, 1%  [R0603]  26.68,123.09 90 top
R806  10k0, 1%  [R0603]  29.18,123.09 90 top
R807  1k2, 1%  [R0603]  31.68,123.09 90 top
R808  12k0, 1%  [R0603]  8.18,137.59 0 top
R809  S10K35  [S10K40]  14.68,143.59 0 top
R810  180R, 1%  [R0603]  31.18,144.09 90 top
R811  1k0, 1%  [R0603]  23.18,144.09 90 top
R812  10k0, 1%  [R0603]  26.18,144.09 90 top
R813  1k2, 1%  [R0603]  28.68,144.09 90 top
R901  4k7, 1%  [R0402]  132.24,163.24 145 top
R902  6k8, 1%  [R0402]  133.59,165.1 145 top
R903  4k7, 1%  [R0402]  127.4,166.55 145 top
R904  6k8, 1%  [R0402]  128.76,168.41 145 top
R905  4k7, 1%  [R0402]  122.82,170.11 145 top
R906  6k8, 1%  [R0402]  123.67,171.47 145 top
RN101  1k0, 5%  [YC124]  110.17,160.42 180 top
RN301  100R  [YC124]  114.18,102.09 180 top
RST  TP  [TP]  81.74,145.99 90 bottom
RX_LED  TLMY1000  [CHIP-LED0603]  90.18,138.34 0 top
SCK  TP  [TP]  79.2,145.99 90 bottom
SJ1  [SJ]  61.18,145.09 180 top
SJ2  [SJ]  61.18,142.59 180 top
SJ3  [SJ_2]  42.93,143.84 0 top
SJ4  [SJ_2]  42.93,141.59 0 top
SJ450  [SJ_2]  27.43,49.09 90 top
SJ460  [SJ_2]  27.68,69.09 90 top
SJ470  [SJ_2]  27.68,79.09 90 top
SJ480  [SJ_2]  27.68,98.59 90 top
SJ550  [SJ_2]  141.18,153.59 270 top
SJ560  [SJ_2]  141.18,133.09 270 top
SJ650  [SJ_2]  113.9,85.16 239 top
SJ660  [SJ_2]  102.84,68.26 241 top
SJ750  [SJ_2]  83.28,25.22 200 top
SJ760  [SJ_2]  63.96,18.35 200 top
TP3V3  TP  [TP]  61.18,167.09 0 bottom
TP5V  TP  [TP]  44.18,165.09 0 bottom
TP24V  TP  [TP]  23.18,164.09 0 bottom
TX_LED  TLMO1000  [CHIP-LED0603]  88.93,138.34 0 top
U$1  [T-BONE_SILK_EXT_WITH_3V3]  -1.32,-1.91 0 top
U$301  TS42  [TS42]  63.18,137.09 0 top
U$501  SN74LVC3G17-SM8  [SN74LVC3G17-SM8]  135.93,117.09 90 top
U$601  SN74LVC3G17-SM8  [SN74LVC3G17-SM8]  92.98,58.53 90 top
U$701  SN74LVC3G17-SM8  [SN74LVC3G17-SM8]  42.18,16.34 0 top
X1  MINI-USB-SCHIELD-32005-301  [32005-301]  96.68,179.84 270 top
X201  MSTBA4  [MSTBA4]  4.75,168.65 235 top
X801  MSTBA2  [MSTBA2]  3.84,125.45 290 top
X802  MSTBA2  [MSTBA2]  -1.02,146.52 270 top

## Tracks (layer width: path | path; a pad name or v marks a point on that pad's centre or on a via)
1V8_ADC_BB  (via drill 0.35)
  Top 0.254: R903.2 126.87,166.28 v126.18,165.59 | v130.68,162.59 R901.2 | R905.2 122.29,168.69 v122.18,168.59 | 83.93,129.34 83.93,128.59 C304.1 | v84.68,139.09 v84.68,137.09 | 83.93,129.34 v81.18,129.34 80.43,128.59 IC301.42 | v68.93,119.34 v72.43,122.84 | 83.93,129.34 v84.68,130.09
  Supply 0.254: v114.43,158.59 v105.18,158.59 | v66.43,116.84 64.43,114.84 v64.18,114.84
  Bottom 0.254: v130.68,162.59 127.68,165.59 v126.18,165.59 123.18,168.59 v122.18,168.59 122.18,167.09 | v84.68,137.09 v84.68,130.09 | v84.68,139.09 84.68,154.09 91.68,161.09 102.68,161.09 v105.18,158.59 | v81.18,129.34 78.93,129.34 78.43,129.84 73.93,129.84 72.43,128.34 v72.43,122.84 | v66.43,116.84 v68.93,119.34
  Bottom 0.3: P9.32 52.44,121.85 52.93,122.34 56.93,122.34 63.93,115.34 63.93,115.09 v64.18,114.84 | 122.18,167.09 122.18,166.34 v114.43,158.59
1WIRE_BB  (via drill 0.35)
  Top 0.3: 53.93,134.59 v54.18,134.84 53.89,134.55 P9.22
  Supply 0.3: v66.43,144.09 66.43,144.59 v68.68,146.84
  Bottom 0.3: v54.18,134.84 53.68,135.34 53.68,137.84 55.93,140.09 57.43,140.09 61.68,144.34 65.18,144.34 65.43,144.09 v66.43,144.09 | v68.68,146.84 72.93,146.84 74.43,148.34 77.43,148.34 96.68,167.59 96.68,169.84 103.93,177.09 112.18,177.09 J101.2
24V_INPUT
  pour Supply: 5.18,168.59 10.18,164.84 18.93,164.84 30.18,176.09 30.18,187.09 5.18,187.09
5031_O1A1  (via drill 0.4)
  Top 0.254: IC401.47 42.68,70.09 v43.18,69.59
  Bottom 0.813: v43.18,69.59 43.18,68.34 40.93,66.09 37.93,66.09 27.18,55.34 19.24,55.34 J402.1
5031_O1A2  (via drill 0.4)
  Top 0.254: IC401.45 v41.68,68.34
  Bottom 0.813: v41.68,68.34 40.68,67.34 37.68,67.34 28.18,57.84 19.2,57.84 J402.2
5031_O1B1  (via drill 0.4)
  Top 0.254: IC401.41 39.68,68.59 v39.81,68.46
  Bottom 0.813: v39.81,68.46 37.31,68.46 29.18,60.34 19.2,60.34 J402.3
5031_O1B2  (via drill 0.4)
  Top 0.254: IC401.39 38.68,70.09 38.43,69.84
  Top 0.813: 38.43,69.84 38.06,69.46 v36.93,69.46
  Bottom 0.813: v36.93,69.46 36.81,69.46 30.18,62.84 19.24,62.84 J402.4
5031_O2A1  (via drill 0.4)
  Top 0.254: IC401.14 42.68,78.34 43.18,78.84 43.68,78.84 43.93,78.59 v43.93,78.34
  Bottom 0.813: v43.93,78.34 36.06,78.34 29.06,85.34 19.24,85.34 J401.1
5031_O2A2  (via drill 0.4)
  Top 0.254: IC401.16 41.68,79.34 41.93,79.59
  Top 0.813: 41.93,79.59 v41.93,81.34
  Bottom 0.813: v41.93,81.34 34.43,81.34 28.18,87.59 19.41,87.59 J401.2
5031_O2B1  (via drill 0.4)
  Top 0.254: IC401.20 39.68,79.59 39.43,79.84
  Top 0.813: 39.43,79.84 v39.43,82.59
  Bottom 0.813: v39.43,82.59 34.68,82.59 26.93,90.34 19.2,90.34 J401.3
5031_O2B2  (via drill 0.4)
  Top 0.254: IC401.22 38.68,78.59 38.43,78.84
  Top 0.813: 38.43,78.84 36.93,78.84 35.93,79.84 35.93,83.59 v35.68,83.84
  Bottom 0.813: v35.68,83.84 34.93,83.84 25.93,92.84 19.24,92.84 J401.4
+3V3  (via drill 0.3, 0.35)
  Top 0.254: IC601.26 82.24,67.16 | IC601.5 71.13,67.16 | IC601.19 78.51,62.01 | IC701.26 35.25,28.03 | IC701.5 35.25,39.14 | IC701.19 29.51,31.92 | IC301.6 76.18,136.59 v75.93,136.84 | R303.2 71.08,136.94 v70.93,137.09 | IC301.14 71.93,128.59 v71.68,128.34 | R105.2 R107.2 R101.2 R103.2 | 64.88,151.59 IC101.8 | IC803.14 71.18,100.34 v72.18,99.34 | IC802.14 86.93,109.34 v87.43,108.84 | IC302.14 111.11,109.16 v110.93,109.34 | IC301.34 79.93,124.59 81.43,123.09 82.33,123.09 L301.1 | L301.1 82.58,121.11 C305.1 | v90.18,133.34 R108.2 R106.2 | L301.1 82.68,122.84 v83.68,123.84 | IC201.4 61.18,172.09 v61.68,171.59 | 72.83,141.24 v72.93,141.34 | IC601.37 76.01,73.63 | v75.68,75.09 75.68,73.96 C602.2 | IC501.37 114.17,128.47 | IC501.5 109.13,123.16 | IC501.19 116.67,118.33 v116.43,118.09 | IC501.26 121.31,123.16 C505.1 | IC701.37 40.76,34.42 C702.2
  Top 0.3: J550.1 145.87,155.63 R551.2 | J560.1 147.22,135.63 146.68,135.09 R561.2 | 114.17,128.47 C502.2 114.06,129.71 v114.18,129.84 | 109.13,123.16 C501.1 109.06,122.21 v108.93,122.09 | 121.31,122.96 C505.1 121.31,123.46 v122.43,124.59 | J650.1 121.49,82.78 120.18,84.09 118.81,84.09 R651.2 117.81,85.09 117.68,85.09 v117.68,86.84 | J660.1 110.98,65.29 108.43,67.84 107.3,67.84 R661.2 | C609.1 102.31,85.21 103.18,86.09 107.43,86.09 v108.18,86.84 | 76.01,73.63 C602.2 | 82.24,67.16 C605.1 82.31,67.84 82.56,68.09 83.56,68.09 v83.81,68.34 | 71.13,67.16 C601.1 71.06,67.71 v70.68,68.09 | 78.51,62.01 v79.18,61.34 | J750.1 88.41,20.47 87.24,21.65 | 87.24,21.65 R751.2 | J760.1 69.62,13.07 R761.2 | IC702.40 68.11,32.41 69.18,31.34 69.18,30.84 | 69.18,30.84 71.43,30.84 71.68,30.59 81.43,30.59 v81.68,30.34 | 69.18,30.84 C709.1 | v87.18,21.59 87.24,21.65 | C705.1 35.25,28.03 35.25,28.02 36.68,26.59 v36.68,26.09 | 35.25,39.14 C701.1 35.06,39.21 34.18,40.09 v33.68,40.09 | 29.51,31.92 v29.18,31.59 | C702.2 v42.18,34.71 | J470.1 23.49,76.55 R471.2 | J480.1 23.99,96.55 R481.2 | J450.1 22.39,46.55 22.93,47.09 R451.2 | J460.1 21.89,66.55 22.43,67.09 R461.2 | R105.2 70.83,155.69 68.93,157.59 v67.43,157.59 | 62.93,157.59 63.11,157.41 C101.1 63.18,154.84 64.18,154.84 64.88,154.14 64.88,151.59 | R108.2 R2.2 | R102.2 72.83,141.24 | 70.93,145.84 70.93,146.09 R103.2 | J101.1 111.64,177.05 R1.2 | U$701.P$8 43.88,18.29 v43.93,18.34 | v89.68,59.34 90.57,60.23 U$601.P$8 | U$501.P$8 133.88,118.79 v133.18,118.09
  Top 0.305: D401.2 47.18,65.59 47.68,65.09 55.93,65.09 56.93,64.09 67.43,64.09 v68.68,65.34
  Top 0.406: IC502.40 134.61,144.02 135.18,144.59 C509.1 136.56,145.46 137.18,146.09 144.18,146.09 147.18,143.09 147.18,135.67 147.22,135.63 | IC602.40 99.74,84.15 100.68,85.09 C609.1
  Top 0.813: IC201.4 59.18,172.09 C205.1 56.18,177.71 C206.1 | v61.18,165.09 61.18,159.34 62.93,157.59 v67.43,157.59
  Bottom 0.254: v72.93,141.34 75.93,141.34 76.68,142.09 76.68,143.43 3V3.P$1
  Bottom 0.3: v117.68,86.84 v108.18,86.84 | v87.18,21.59 87.18,24.84 v81.68,30.34
  Bottom 0.813: TP3V3.P$1 v61.18,165.09 | v67.43,157.59 67.43,143.34 v67.93,142.84
  other vias: 61.68,173.59 61.68,172.59 61.68,170.59 61.68,169.59
  pour Supply (rank 2): 11.68,104.59 19.68,106.59 21.18,103.09 21.18,45.59 21.68,39.59 23.68,31.09 27.68,21.09 30.68,15.09 35.68,10.09 44.18,6.59 50.68,6.09 89.18,20.09 100.68,49.09 122.18,85.09 148.18,115.59 148.18,155.59 136.68,164.84 122.68,175.09 119.18,177.09 86.68,177.09 86.68,188.09 159.18,188.09 159.18,-1.91 1.18,-1.91 1.18,104.59
  pour Supply (rank 2): 112.68,131.09 118.18,131.09 123.18,126.09 123.18,125.09 126.18,122.09 157.18,122.09 145.18,99.59 109.68,100.09 109.68,121.09 108.18,121.09 108.18,124.09 109.68,124.09 109.68,128.09
  pour Supply (rank 2): 66.18,66.09 66.18,72.09 71.18,77.09 79.18,77.09 84.18,72.09 84.18,69.09 85.18,68.09 85.18,63.09 88.18,60.09 90.18,60.09 109.68,49.59 104.68,39.59 99.68,42.59 82.68,54.09 80.18,54.09 73.18,61.09 71.18,61.09
  pour Supply (rank 2): 21.18,18.09 21.18,39.09 25.18,43.09 42.18,43.09 45.18,40.09 45.18,22.09 48.18,19.09 48.18,5.09 45.18,2.09 33.18,6.09 25.68,10.59
  pour Supply: 90.18,188.09 90.18,156.59 60.68,156.59 60.68,188.09
  pour Top: 60.18,188.09 67.43,188.09 67.43,159.09 60.68,159.09 58.68,161.09 58.68,175.59 60.18,177.09
  pour Supply: 66.18,144.09 84.68,144.09 91.43,138.59 91.43,110.59 84.18,104.59 75.18,104.59 73.68,103.09 73.68,98.59 70.68,95.59 66.18,95.59 62.68,99.09 62.68,140.59
+3V3_BB
  Top 0.3: P9.4 P9.3
+5V  (via drill 0.35)
  Top 0.3: R501.2 R502.2 R503.2 138.68,110.34 v146.93,110.34 | J601.1 107.81,57.96 108.43,57.34 108.43,51.59 103.93,47.09 101.68,47.09 v99.18,49.59 98.43,50.34 R603.2 R602.2 | R701.2 R702.2 R703.2 34.43,13.49 34.43,12.34 35.68,11.09 v36.68,11.09 | v153.43,127.09 151.18,127.09 J501.1 | R601.2 R602.2 | R602.2
  Top 0.406: v34.18,162.09 R203.2
  Top 0.61: P9.6 P9.5
  Top 0.813: IC201.3 51.12,169.79 L201.1 | C202.1 50.81,177.71 C201.1 50.68,176.59 49.18,175.09 49.18,172.45 L201.1 | L201.1 49.18,171.73 49.18,168.09 46.18,165.09 C210.1 46.06,165.09 v43.18,165.09 44.93,163.34 44.93,157.21 47.62,154.53 | R501.2 133.68,100.34 v131.18,97.84 | v99.18,49.59 99.18,46.09 v96.68,43.59 | P9.6 47.96,154.87 47.62,154.53 | 47.62,154.53 46.18,153.09 46.18,114.09 42.18,110.09 27.18,110.09 v22.18,105.09
  Supply 0.813: 61.18,11.59 61.18,8.62 J701.1 | v22.18,105.09 21.68,104.59 21.68,40.59 23.18,39.09 v23.18,34.09
  Bottom 0.3: v153.43,127.09 153.43,125.84 155.68,123.59 155.68,120.59 153.18,118.09 153.18,116.59 v146.93,110.34
  Bottom 0.813: TP5V.P$1 v43.18,165.09 40.68,162.59 34.68,162.59 v34.18,162.09 | v23.18,34.09 23.18,30.09 26.18,27.09 26.18,19.09 29.18,16.09 29.18,14.09 32.18,11.09 v36.68,11.09
  pour Supply: 35.93,10.09 37.43,8.59 41.18,6.84 47.43,5.59 52.43,6.34 64.18,10.59 89.18,19.84 97.93,36.09 98.93,43.84 97.43,45.09 95.43,44.34 95.43,41.09 94.93,36.09 93.18,33.34 81.43,22.09 67.18,14.59 57.93,11.34 50.68,9.34 44.18,9.84 40.68,10.34 38.18,10.59 36.68,11.59 35.43,11.34 35.68,10.09
  pour Supply: 98.18,50.09 98.18,49.09 99.18,48.09 100.18,48.09 100.43,48.34 122.43,86.09 134.43,99.34 122.68,99.59 124.18,98.84 125.43,97.59 126.43,95.34 126.43,94.59 125.93,93.84 113.93,82.34 107.93,74.09 100.18,60.09 97.93,53.34 97.93,50.59
+24V  (via drill 0.3, 0.35)
  Top 0.254: IC401.30 35.43,74.59 v35.18,74.84 | C406.2 v31.68,68.84 | C401.1 v30.56,77.09
  Top 0.3: IC.1 30.5,169.02 30.43,169.09 30.43,169.84 30.31,169.96 | J801.1 105.91,176.61 106.18,176.34 R801.2 104.03,175.19 v103.68,174.84 | C606.1 102.21,75.37 102.68,75.84 102.68,77.2 C608.1 102.56,77.21 v101.06,78.71 100.68,79.09 100.68,80.09 100.16,80.61 100.16,80.95 | v64.36,38.48 64.91,37.93 IC702.36 64.91,30.09 | 64.91,30.09 64.91,29.89 C708.1 64.11,30.09 63.43,30.09 63.18,30.34 v63.18,31.09 62.93,31.34 62.43,31.34 61.55,32.22 C706.1 | C710.1 66.31,30.71 65.68,30.09 64.91,30.09 | D801.C v109.68,170.34
  Top 0.406: R201.2 30.08,169.74 30.31,169.96 v30.68,170.34 30.18,170.84 C208.1 | C204.1 v32.18,163.59 | C510.1 136.68,142.46 C508.1 136.68,138.09 136.31,137.71 C506.1 132.81,137.71 132.43,138.09 130.68,138.09 129.93,138.84 v127.68,138.84 | IC502.36 128.41,140.82 v127.68,140.09 | C610.1 100.16,80.95 IC602.36 94.48,80.95 v93.79,80.27
  Top 0.61: C507.1 v134.68,152.59
  Top 0.813: C203.2 22.1,164.17 v24.18,162.09 | C512.2 v139.68,127.09 | C607.1 100.7,94.07 v100.68,94.09 | C712.2 52.1,30.75 v51.68,30.34 | C707.1 v78.68,33.09 | C407.2 v41.93,56.59 | C408.2 v43.43,90.09 | C612.2 95.23,69.04 v95.18,69.09
  Top 1.016: D201.C 37.37,179.34 F201.2A
  Bottom 0.3: v24.18,162.09 24.18,163.09 TP24V.P$1
  other vias: 24.68,152.59 25.68,152.59 26.68,152.59 27.68,152.59 28.68,152.59 28.68,151.59 28.68,150.59 28.68,149.59 28.68,148.59 28.68,147.59 27.68,147.59 27.68,148.59 27.68,149.59 27.68,150.59 27.68,151.59 26.68,151.59 26.68,150.59 26.68,149.59 26.68,148.59 26.68,147.59 25.68,147.59 25.68,148.59 25.68,149.59 25.68,150.59 25.68,151.59 24.68,151.59 24.68,150.59 24.68,149.59 24.68,149.59 24.68,148.59 24.68,147.59 22.68,154.09 23.68,154.09 24.68,154.09 25.68,154.09 26.68,154.09 27.68,154.09 28.68,154.09 29.68,154.09 30.68,154.09 30.68,153.09 30.68,152.09 30.68,151.09 30.68,150.09 30.68,149.09 30.68,148.09 30.68,147.09 31.68,147.09 31.68,148.09 31.68,149.09 31.68,150.09 31.68,151.09 31.68,152.09 31.68,153.09 31.68,154.09 32.68,154.09 33.68,154.09 34.68,154.09 32.68,153.09 32.68,152.09 32.68,152.09 32.68,151.09 32.68,150.09 32.68,149.09 32.68,148.09 33.68,148.09 34.68,148.09 34.68,149.09 33.68,149.09 33.68,150.09 33.68,150.09 33.68,150.09 33.68,150.09 34.68,150.09 34.68,151.09 33.68,151.09 33.68,152.09 34.68,152.09 34.68,153.09 33.68,153.09 35.68,148.09 35.68,149.09 35.68,150.09 36.68,150.09 36.68,149.09 36.68,148.09 30.18,132.59 31.18,132.59 32.18,132.59 33.18,132.59 34.18,132.59 34.18,131.59 34.18,130.59 34.18,130.59 34.18,129.59 34.18,128.59 34.18,127.59 33.18,127.59 32.18,127.59 31.18,127.59 30.18,127.59 30.18,128.59 31.18,128.59 32.18,128.59 33.18,128.59 33.18,129.59 33.18,130.59 33.18,131.59 32.18,131.59 32.18,130.59 32.18,129.59 31.18,130.59 31.18,129.59 30.18,130.59 30.18,129.59 30.18,130.59 30.18,131.59 31.18,131.59 28.18,134.09 29.18,134.09 30.18,134.09 31.18,134.09 32.18,134.09 33.18,134.09 34.18,134.09 35.18,134.09 35.18,134.09 36.18,134.09 36.18,133.09 36.18,132.09 36.18,131.09 36.18,130.09 36.18,129.09 36.18,128.09 37.18,128.09 37.18,127.09 37.18,129.09 38.18,129.09 39.18,129.09 40.18,129.09 41.18,129.09 41.18,128.09 41.18,127.09 41.18,130.09 40.18,130.09 39.18,130.09 39.18,131.09 39.18,132.09 39.18,133.09 39.18,134.09 38.18,134.09 38.18,133.09 38.18,132.09 38.18,131.09 38.18,130.09 37.18,130.09 37.18,131.09 37.18,132.09 37.18,133.09 37.18,134.09 126.93,140.09 127.31,139.46 126.93,138.84 126.93,147.59 127.68,147.59 127.31,146.96 126.93,146.34 127.68,146.34 92.91,87.68 93.66,87.67 93.28,87.05 92.89,86.43 93.64,86.42 92.88,80.28 93.32,79.66 92.88,79.03 93.75,79.03 71.53,39.36 71.51,38.61 70.89,39 70.28,39.38 70.26,38.63 64.38,39.39 63.75,38.96 63.13,39.39 63.13,38.52 40.43,79.9 40.99,79.34 40.56,69.71 40.81,68.96
  pour Supply (rank 6): -3.82,189.09 165.18,189.09 165.18,-3.91 -3.82,-3.91
  pour Top (rank 2): 35.18,155.09 35.18,153.09 37.18,153.09 37.18,145.59 36.18,144.59 32.68,144.59 30.18,147.09 21.68,147.09 21.68,155.09
  pour Top (rank 2): 40.18,135.09 40.18,133.09 42.18,133.09 42.18,125.59 41.18,124.59 37.68,124.59 35.18,127.09 26.68,127.09 26.68,135.09
  pour Top (no thermals): 126.68,149.34 127.43,149.34 127.43,148.09 127.93,148.09 127.93,145.84 126.68,145.84
  pour Top (no thermals): 127.43,137.09 126.68,137.09 126.68,140.59 127.43,140.59 127.93,140.59 127.93,138.59 127.43,138.59
  pour Top (no thermals): 92.69,89.44 93.44,89.42 93.42,88.17 93.92,88.17 93.88,85.92 92.63,85.94
  pour Top (no thermals): 93.38,77.28 92.63,77.28 92.63,80.78 93.38,80.78 94.22,80.69 94.22,78.69 93.38,78.78
  pour Top (no thermals): 73.28,39.58 73.27,38.83 72.02,38.85 72.01,38.35 69.76,38.39 69.78,39.64
  pour Top (no thermals): 61.38,38.89 61.38,39.64 64.88,39.64 64.88,38.89 64.78,38.05 62.78,38.05 62.88,38.89
  pour Top (no thermals): 39.93,77.34 41.43,77.34 41.43,81.09 39.93,81.09
  pour Top (no thermals): 39.93,67.59 41.43,67.59 41.43,71.34 39.93,71.34
A_74LVC_1  (via drill 0.35)
  Top 0.254: IC501.40 112.67,126.1
  Top 0.3: v135.68,124.59 135.68,120.09 135.58,119.99 U$501.P$7 | 112.67,126.1 v112.18,126.59
  Bottom 0.3: v135.68,124.59 133.18,127.09 112.68,127.09 v112.18,126.59
A_74LVC_2  (via drill 0.35)
  Top 0.254: IC601.40 74.51,70.76 v74.18,71.09
  Top 0.3: v83.93,71.59 88.43,71.59 91.68,68.34 91.68,62.09 92.63,61.15 U$601.P$7
  Bottom 0.3: v74.18,71.09 83.43,71.09 v83.93,71.59
A_74LVC_3  (via drill 0.35)
  Top 0.254: IC701.40 38.01,35.92 39.18,37.09 39.18,39.09 v41.18,41.09
  Top 0.3: U$701.P$7 45.58,16.69 v45.68,16.59
  Bottom 0.3: v41.18,41.09 43.43,38.84 43.43,27.34 40.68,24.59 40.68,21.09 41.68,20.09 44.68,20.09 46.18,18.59 46.18,17.09 v45.68,16.59
A_4361_1  (via drill 0.35)
  Top 0.3: v147.68,116.09 147.68,117.09 148.18,117.59 148.18,120.09 149.18,121.09 149.18,122.59 151.18,124.59 J501.2 | v133.68,116.09 134.38,115.39 U$501.P$1 134.93,113.84 133.68,112.59 R501.1
  Bottom 0.3: v147.68,116.09 147.18,116.59 137.18,116.59 136.68,116.09 v133.68,116.09
A_4361_2  (via drill 0.35)
  Top 0.3: R601.1 91.56,52.07 91.56,52.96 91.98,53.38 U$601.P$1 91.42,56.83 v91.18,56.59
  Bottom 0.3: J601.2 106.43,55.84 91.93,55.84 v91.18,56.59
A_4361_3  (via drill 0.35)
  Top 0.3: R701.1 37.18,18.59 38.43,17.34 U$701.P$1 40.68,17.34 v41.43,18.09
  Bottom 0.3: v41.43,18.09 43.43,16.09 43.43,15.59 45.68,13.34 48.18,13.34 53.43,8.09 56.18,8.09 56.43,8.34 58.18,8.34 59.26,7.26 J701.2
B_74LVC_1  (via drill 0.35)
  Top 0.254: IC501.10 110.75,120.66
  Top 0.3: 110.75,120.66 v110.68,120.59 | 138.09,121.49 v138.18,121.59 136.88,120.29 U$501.P$5
  Bottom 0.3: v110.68,120.59 137.18,120.59 v138.18,121.59
B_74LVC_2  (via drill 0.35)
  Top 0.254: IC601.10 73.13,64.66
  Top 0.3: 73.13,64.66 72.99,64.53 v72.93,64.59 | U$601.P$5 93.93,64.35 v93.68,64.59
  Bottom 0.3: v93.68,64.59 93.43,64.84 81.43,64.84 81.18,64.59 v72.93,64.59
B_74LVC_3  (via drill 0.35)
  Top 0.254: IC701.10 32.75,37.77
  Top 0.3: 32.75,37.77 32.43,38.09 30.93,38.09 v30.68,37.84 | v43.18,13.59 43.78,14.18 43.78,15.28 U$701.P$5
  Bottom 0.3: v43.18,13.59 43.18,14.09 40.18,17.09 40.18,23.59 29.18,34.59 29.18,36.34 v30.68,37.84
B_4361_1  (via drill 0.35)
  Top 0.3: J501.3 148.68,119.59 v148.68,117.09 | v136.68,117.09 136.23,116.64 U$501.P$3 136.23,111.99 R502.1
  Bottom 0.3: v136.68,117.09 v148.68,117.09
B_4361_2  (via drill 0.35)
  Top 0.3: 94.75,53.41 v94.68,53.34 | R602.1 93.09,52.99 93.18,53.09 94.43,53.09 v94.68,53.34 | U$601.P$3 93.28,54.75 v94.68,53.34
  Bottom 0.3: 105.18,53.51 J601.3 105.02,53.34 v94.68,53.34
B_4361_3  (via drill 0.35)
  Top 0.3: R702.1 36.08,16.04 U$701.P$3 42.23,16.04 v42.43,15.84
  Bottom 0.3: v42.43,15.84 45.43,12.84 47.93,12.84 53.18,7.59 55.68,7.59 56.88,6.4 J701.3
CLK_32U4  (via drill 0.35)
  Top 0.254: IC301.32 78.18,122.59 79.43,121.34 79.43,119.84 79.93,119.34 v86.93,119.34 | IC302.3 113.46,105.12 112.18,103.84 v111.68,103.84 | IC302.5 114.46,105.06 v114.93,104.59 | IC302.9 114.96,111.81 113.93,112.84 108.68,112.84 v107.68,111.84 | IC302.1 111,107.66 v110.43,107.09
  Top 0.3: v101.18,105.34 102.43,104.09 v105.18,104.09
  Bottom 0.254: v114.93,104.59 114.93,104.09 114.68,103.84 v111.68,103.84 | v107.68,111.84 107.68,106.84 | 107.68,106.84 107.68,106.59 v105.18,104.09 | v110.43,107.09 107.93,107.09 107.68,106.84
  Bottom 0.3: v101.18,105.34 96.93,105.34 86.93,115.34 v86.93,119.34 | v105.18,104.09 111.43,104.09 v111.68,103.84
CLK_EXT_1  (via drill 0.35)
  Top 0.3: RN301.5 113.38,101.29 113.18,101.09 113.18,100.34 113.43,100.09 113.43,99.59 109.68,95.84 75.93,95.84 67.18,87.09 57.93,87.09 v57.18,86.34 | IC401.11 v46.18,76.59
  Bottom 0.3: v46.18,76.59 46.93,75.84 54.68,75.84 56.18,77.34 56.18,81.59 57.43,82.84 57.43,86.09 v57.18,86.34
CLK_EXT_2  (via drill 0.35)
  Top 0.254: IC501.38 113.67,127.35 113.18,127.84 v113.18,129.59
  Top 0.3: v113.18,129.59 113.18,139.09 114.11,140.02 IC502.21 | v113.93,100.84 RN301.6 | v105.93,129.59 v105.93,100.84
  Bottom 0.3: v105.93,100.84 v113.93,100.84 | v113.18,129.59 v105.93,129.59
CLK_EXT_3  (via drill 0.35)
  Top 0.254: IC601.38 75.51,72.51
  Top 0.3: 75.51,72.51 74.93,73.09 74.93,93.84 v75.68,94.59 76.43,95.34 109.93,95.34 114.68,100.09 114.68,101.09 114.43,101.34 RN301.7 | IC602.21 83.49,80.15 v83.43,80.09
  Bottom 0.3: v83.43,80.09 83.43,81.59 75.93,89.09 75.93,94.34 v75.68,94.59
CLK_EXT_4  (via drill 0.35)
  Top 0.254: IC701.38 39.01,34.92
  Top 0.3: IC702.21 64.11,51.91 62.93,53.09 60.43,53.09 59.68,52.34 v59.68,51.59 | 39.01,34.92 39.68,35.59 42.18,35.59 47.68,41.09 v49.18,41.09 | RN301.8 114.98,101.54 115.43,101.09 115.43,100.09 110.18,94.84 77.18,94.84 v76.93,94.59
  Supply 0.3: v76.93,94.59 v74.18,91.84
  Bottom 0.3: v49.18,41.09 v59.68,51.59 59.68,52.34 57.43,54.59 57.43,72.34 59.68,74.59 59.68,79.84 61.93,82.09 64.43,82.09 v74.18,91.84
CS_4361_1  (via drill 0.35)
  Top 0.254: IC803.4 68.18,105.34 67.93,105.59 67.93,107.09 69.43,108.59 v74.93,108.59 | IC501.2 110.86,124.66 109.68,125.84 v108.43,125.84
  Bottom 0.3: v108.43,125.84 108.43,124.84 105.93,122.34 105.93,115.34 106.18,115.09 106.18,106.84 101.68,102.34 85.68,102.34 79.43,108.59 v74.93,108.59
CS_4361_1_32U4  (via drill 0.35)
  Top 0.254: IC301.25 74.68,118.59 v67.43,111.34 | IC803.5 67.68,104.59 66.93,105.34 v66.93,106.34
  Bottom 0.254: v66.93,106.34 66.93,110.84 v67.43,111.34
CS_4361_1_BB  (via drill 0.35)
  Top 0.254: IC803.6 67.18,104.09 v66.43,104.84
  Top 0.3: v70.93,110.21 v74.93,110.21 | v86.18,117.59 86.43,117.59 v88.18,119.34
  Supply 0.254: v94.43,126.09 v94.43,129.34 | v94.93,136.59 94.93,139.81 P8.15
  Bottom 0.254: v94.93,136.59 94.43,136.09 v94.43,129.34 | 94.43,124.34 v94.43,126.09 | v86.18,117.59 85.68,117.09 85.68,112.34 84.93,111.59 76.68,111.59 | 68.18,106.09 68.18,105.84 67.43,105.09 66.68,105.09 v66.43,104.84
  Bottom 0.3: 76.68,111.59 76.31,111.59 v74.93,110.21 | 68.18,106.09 68.18,109.46 68.68,109.96 70.68,109.96 v70.93,110.21 | 94.43,124.34 89.43,119.34 v88.18,119.34
CS_4361_2  (via drill 0.35)
  Top 0.254: IC803.10 67.68,97.59 v66.93,96.84 | IC601.2 72.86,68.66 72.68,68.84 72.68,69.84 71.93,70.59 v69.68,70.59
  Top 0.3: v66.93,85.59 v68.68,83.84
  Bottom 0.3: v66.93,85.59 v66.93,96.84 | v69.68,70.59 69.68,82.84 v68.68,83.84
CS_4361_2_32U4  (via drill 0.35)
  Top 0.254: IC301.26 75.18,118.34 68.43,111.59 v68.43,111.34 | IC803.8 64.68,100.34 63.93,101.09 v63.93,102.59
  Bottom 0.254: v63.93,102.59 63.93,103.59 65.93,105.59 67.18,105.59 67.68,106.09 67.68,106.84 67.43,107.09 67.43,110.34 v68.43,111.34
CS_4361_2_BB  (via drill 0.35)
  Top 0.254: IC803.9 67.18,98.09 v66.93,98.09 | v92.68,130.09 v95.18,130.09 | P8.17 96.47,139.63 v93.93,137.09 | v87.68,105.09 82.18,105.09 81.18,106.09 72.93,106.09 v71.93,105.09 | v90.81,112.96 88.18,110.34 v88.18,107.09
  Supply 0.254: v96.18,123.59 94.93,124.84 94.93,125.59 95.18,125.84 95.18,127.84 94.93,128.09 94.93,128.84 95.18,129.09 v95.18,130.09
  Bottom 0.254: v96.18,123.59 95.93,123.59 89.68,117.34 89.68,115.21 90.81,114.09 v90.81,112.96 | v92.68,130.09 92.93,130.34 92.93,136.09 v93.93,137.09 | v71.93,105.09 71.93,103.59 70.43,102.09 70.43,100.09 68.43,98.09 v66.93,98.09 | v87.68,105.09 88.18,105.59 v88.18,107.09
CS_4361_3  (via drill 0.35)
  Top 0.254: IC701.2 36.75,37.41 37.18,37.84 37.18,41.84 v39.93,44.59 | v56.18,60.84 56.18,61.34 57.18,62.34 v58.68,62.34 | IC803.13 69.18,98.59 70.43,97.34 70.68,97.34 v70.93,97.09 | v59.18,72.34 60.93,74.09 61.18,74.09 61.68,74.59 61.68,75.34 61.43,75.59 57.18,75.59 v55.18,77.59 | v58.18,95.84 v68.93,95.84
  Supply 0.254: v70.93,97.09 69.68,95.84 v68.93,95.84
  Bottom 0.254: v39.93,44.59 44.18,48.84 44.43,48.84 56.18,60.59 v56.18,60.84 | v59.18,72.34 58.43,71.59 58.43,62.59 v58.68,62.34 | v55.18,77.59 55.68,78.09 55.68,81.84 56.93,83.09 56.93,85.34 56.43,85.84 56.43,86.59 56.93,87.09 57.18,87.09 57.68,87.59 57.93,87.59 58.43,88.09 58.43,95.59 v58.18,95.84
CS_4361_3_32U4  (via drill 0.35)
  Top 0.254: IC301.27 75.68,118.09 74.18,116.59 v74.18,111.34 | IC803.11 68.18,98.09 70.43,95.84 73.93,95.84 v74.18,95.59
  Bottom 0.254: v74.18,111.34 73.93,111.09 73.93,95.84 v74.18,95.59
CS_4361_3_BB  (via drill 0.35)
  Top 0.254: v101.93,125.34 101.18,124.59 101.18,108.59 100.43,107.84 99.18,107.84 98.68,107.34 98.68,97.59 97.43,96.34 70.68,96.34 68.68,98.34 IC803.12
  Supply 0.254: v106.18,131.59 105.68,131.59 105.18,131.09 105.18,130.09 103.68,128.59 103.68,127.09 v101.93,125.34
  Bottom 0.254: P8.18 100.15,139.63 106.18,133.59 v106.18,131.59
CS_5041  (via drill 0.35)
  Top 0.254: IC803.1 v71.18,101.84 | IC401.3 45.56,72.59 46.68,71.46 46.68,70.34 v46.18,69.84
  Top 0.3: v48.43,69.84 48.68,69.84 48.68,70.59 49.93,71.84 v50.18,71.84 | v59.18,86.34 59.43,86.59 v67.68,86.59
  Bottom 0.3: v48.43,69.84 48.18,69.59 46.43,69.59 v46.18,69.84 | v59.18,86.34 59.18,83.59 58.93,83.34 58.93,82.09 57.68,80.84 57.68,75.59 54.43,72.34 52.18,72.34 51.81,72.71 51.06,72.71 v50.18,71.84 | v67.68,86.59 67.43,86.84 67.43,96.34 71.18,100.09 v71.18,101.84
CS_5041_32U4  (via drill 0.35)
  Top 0.254: IC301.12 72.43,129.59 72.18,129.84 72.18,131.09 v72.68,131.59 | v69.18,106.09 IC803.2
  Supply 0.254: v72.68,131.59 69.93,131.59 69.68,131.34 69.68,106.59 v69.18,106.09
CS_5041_BB  (via drill 0.35)
  Top 0.254: IC803.3 68.68,105.59 68.43,105.84 68.43,106.59 68.93,107.09 81.93,107.09 82.68,106.34 91.18,106.34 91.93,107.09 95.68,107.09 v95.93,107.34 | v101.43,136.34 101.43,140.09 100.43,141.09 98.93,141.09 98.68,141.34 98.68,143.31 P8.13
  Supply 0.254: v102.93,127.59 102.93,128.59 103.68,129.34 103.68,129.84 103.43,130.09 v103.43,131.84
  Bottom 0.254: v102.93,127.59 103.18,127.34 103.18,110.59 100.43,107.84 96.43,107.84 v95.93,107.34 | v103.43,131.84 103.43,134.59 101.68,136.34 v101.43,136.34
D_N
  Top 0.254: IC301.3 77.68,141.3 94.88,158.51 94.88,168.54 95.18,168.84 R301.1
D_P
  Top 0.254: IC301.4 77.18,141.38 94.48,158.67 94.48,168.54 94.18,168.84 94.18,169.31 R302.1
FB_HEAT1  (via drill 0.35)
  Top 0.254: IC301.40 82.43,127.59 82.93,127.09 86.43,127.09 v87.93,125.59
  Top 0.3: R806.1 29.18,121.09 30.18,120.09 | 30.18,120.09 D803.C | v29.68,120.09 30.18,120.09
  Bottom 0.254: P9.33 49.72,119.31 50.43,118.59 50.43,115.34
  Bottom 0.3: v29.68,120.09 44.18,120.09 48.93,115.34 50.43,115.34 52.18,115.34 54.43,113.09 78.18,113.09 87.93,122.84 v87.93,125.59
FB_HEAT2  (via drill 0.25, 0.35)
  Top 0.254: IC301.41 82.68,128.09 83.18,127.59 86.18,127.59 86.68,128.09 86.68,133.34 85.93,134.09 v80.68,134.09 | v29.43,141.09 D805.C | v47.68,127.84 47.68,129.84 48.68,130.84 v50.18,130.84
  Top 0.3: R812.1 27.03,143.24 27.18,143.09 27.18,141.34 27.43,141.09 D805.C
  Bottom 0.254: v29.43,141.09 38.43,141.09 48.68,130.84 | v50.18,130.84 48.68,130.84 | v50.18,130.84 67.93,130.84 71.43,134.34 73.18,134.34 73.43,134.09 v80.68,134.09 | P9.35 49.04,117.48 47.68,118.84 v47.68,127.84 | v50.18,130.84 48.68,130.84
GND  (via drill 0.3, 0.35)
  Top 0.254: IC601.17 77.51,65.32 | IC601.13 75.51,65.36 | IC601.15 76.51,65.45 | IC601.22 78.55,65.16 | IC601.25 78.36,66.66 | IC601.6 74.61,66.66 | IC701.6 34.75,35.66 | IC701.13 33.01,34.92 | IC701.15 33.26,33.92 | IC701.17 33.35,32.92 | IC701.18 33.01,32.42 | IC701.25 34.75,32.03 | IC701.22 33.25,31.53 | IC701.34 36.51,32.92 | IC701.36 36.6,33.92 | IC401.31 34.62,74.09 v34.37,74.34 | IC401.34 v38.43,72.59 | IC401.43 v40.68,72.59 | IC401.6 42.93,74.09 v42.56,74.46 | IC401.9 42.68,75.59 v42.56,75.71 | IC401.18 v40.68,76.34 | IC301.5 76.68,137.34 76.18,137.84 v76.18,139.09 | IC301.35 80.43,125.09 v80.68,124.84 | IC301.23 73.68,124.71 v74.31,125.34 | IC301.15 74.06,128.09 v74.31,127.84 | IC802.7 v80.93,110.84 | R304.2 80.83,120.69 v81.43,120.09 83.93,120.09 84.18,120.34 84.18,120.96 C305.2 | IC302.7 115.84,106.74 v115.81,106.71 | IC302.13 112.23,110.13 v112.06,109.96 | IC802.12 84.68,107.21 v84.81,107.09 | IC601.36 76.51,69.04 v76.06,68.59 | IC601.34 77.51,68.88 | IC401.29 35.93,75.09 35.43,75.59 35.06,75.59 C401.2 | IC401.24 37.68,77.09 v38.43,76.34 | IC501.34 115.67,125.08 v115.18,124.59 114.67,125.1 IC501.36 | IC501.6 112.75,122.66 v113.18,123.09 | IC501.15 114.67,121.08 v115.18,121.59 | IC501.17 115.67,121.1 | IC501.22 116.61,121.16 v116.18,121.59 | IC501.13 113.67,121.08 v114.18,121.59 | IC401.12 43.18,77.09 42.68,76.59 42.43,76.59 v42.18,76.34 | IC401.49 v40.31,74.46 | IC301.43 v78.06,129.09
  Top 0.3: IC.7 37.25,167.52 37.68,167.09 37.68,165.09 37.18,164.59 36.33,164.59 R204.1 | 115.67,121.1 v115.18,121.59 | 114.67,121.1 v114.18,121.59 | IC501.25 117,122.66 v116.68,122.34 | 77.51,65.32 v77.37,65.46 | 75.51,65.36 v75.62,65.46 | 76.51,65.45 v76.49,65.46 | 78.55,65.16 v78.24,65.46 | 78.36,66.66 v78.31,66.71 | 77.51,68.88 v77.81,68.59 | 74.61,66.66 v75.18,66.09 | C608.2 102.67,81.7 C610.2 | 34.75,35.66 v34.43,35.34 | 33.01,34.92 v33.43,35.34 | 33.26,33.92 v33.43,34.09 | 33.35,32.92 v33.43,32.84 33.01,32.42 | 34.75,32.03 v34.93,32.21 | 33.25,31.53 v33.93,32.21 | 36.51,32.92 v36.43,32.84 | 36.6,33.92 v36.43,34.09 | U$601.P$4 94.67,56.83 v94.68,56.84 | U$701.P$4 40.48,14.29 41.18,13.59 v42.18,13.59
  Bottom 0.254: v76.18,139.09 78.18,141.09 79.43,141.09 81.74,143.4 GND.P$1